# EasyEDA Pro project ZYNQ7020核心板-双DDR-V2.1.epro, schematic Schematic1_4

## Sheets
1 POWER: Board Name: 核心板_双面; Create Date: 2025-01-06; Page Name: POWER; Project Name: ZYNQ7020核心板-双DDR; Schematic Name: Schematic1_4; Update Date: 2025-04-12; Company: ZXLAB; Page Size: A4; Reviewed: ZXLAB; Version: V1.2
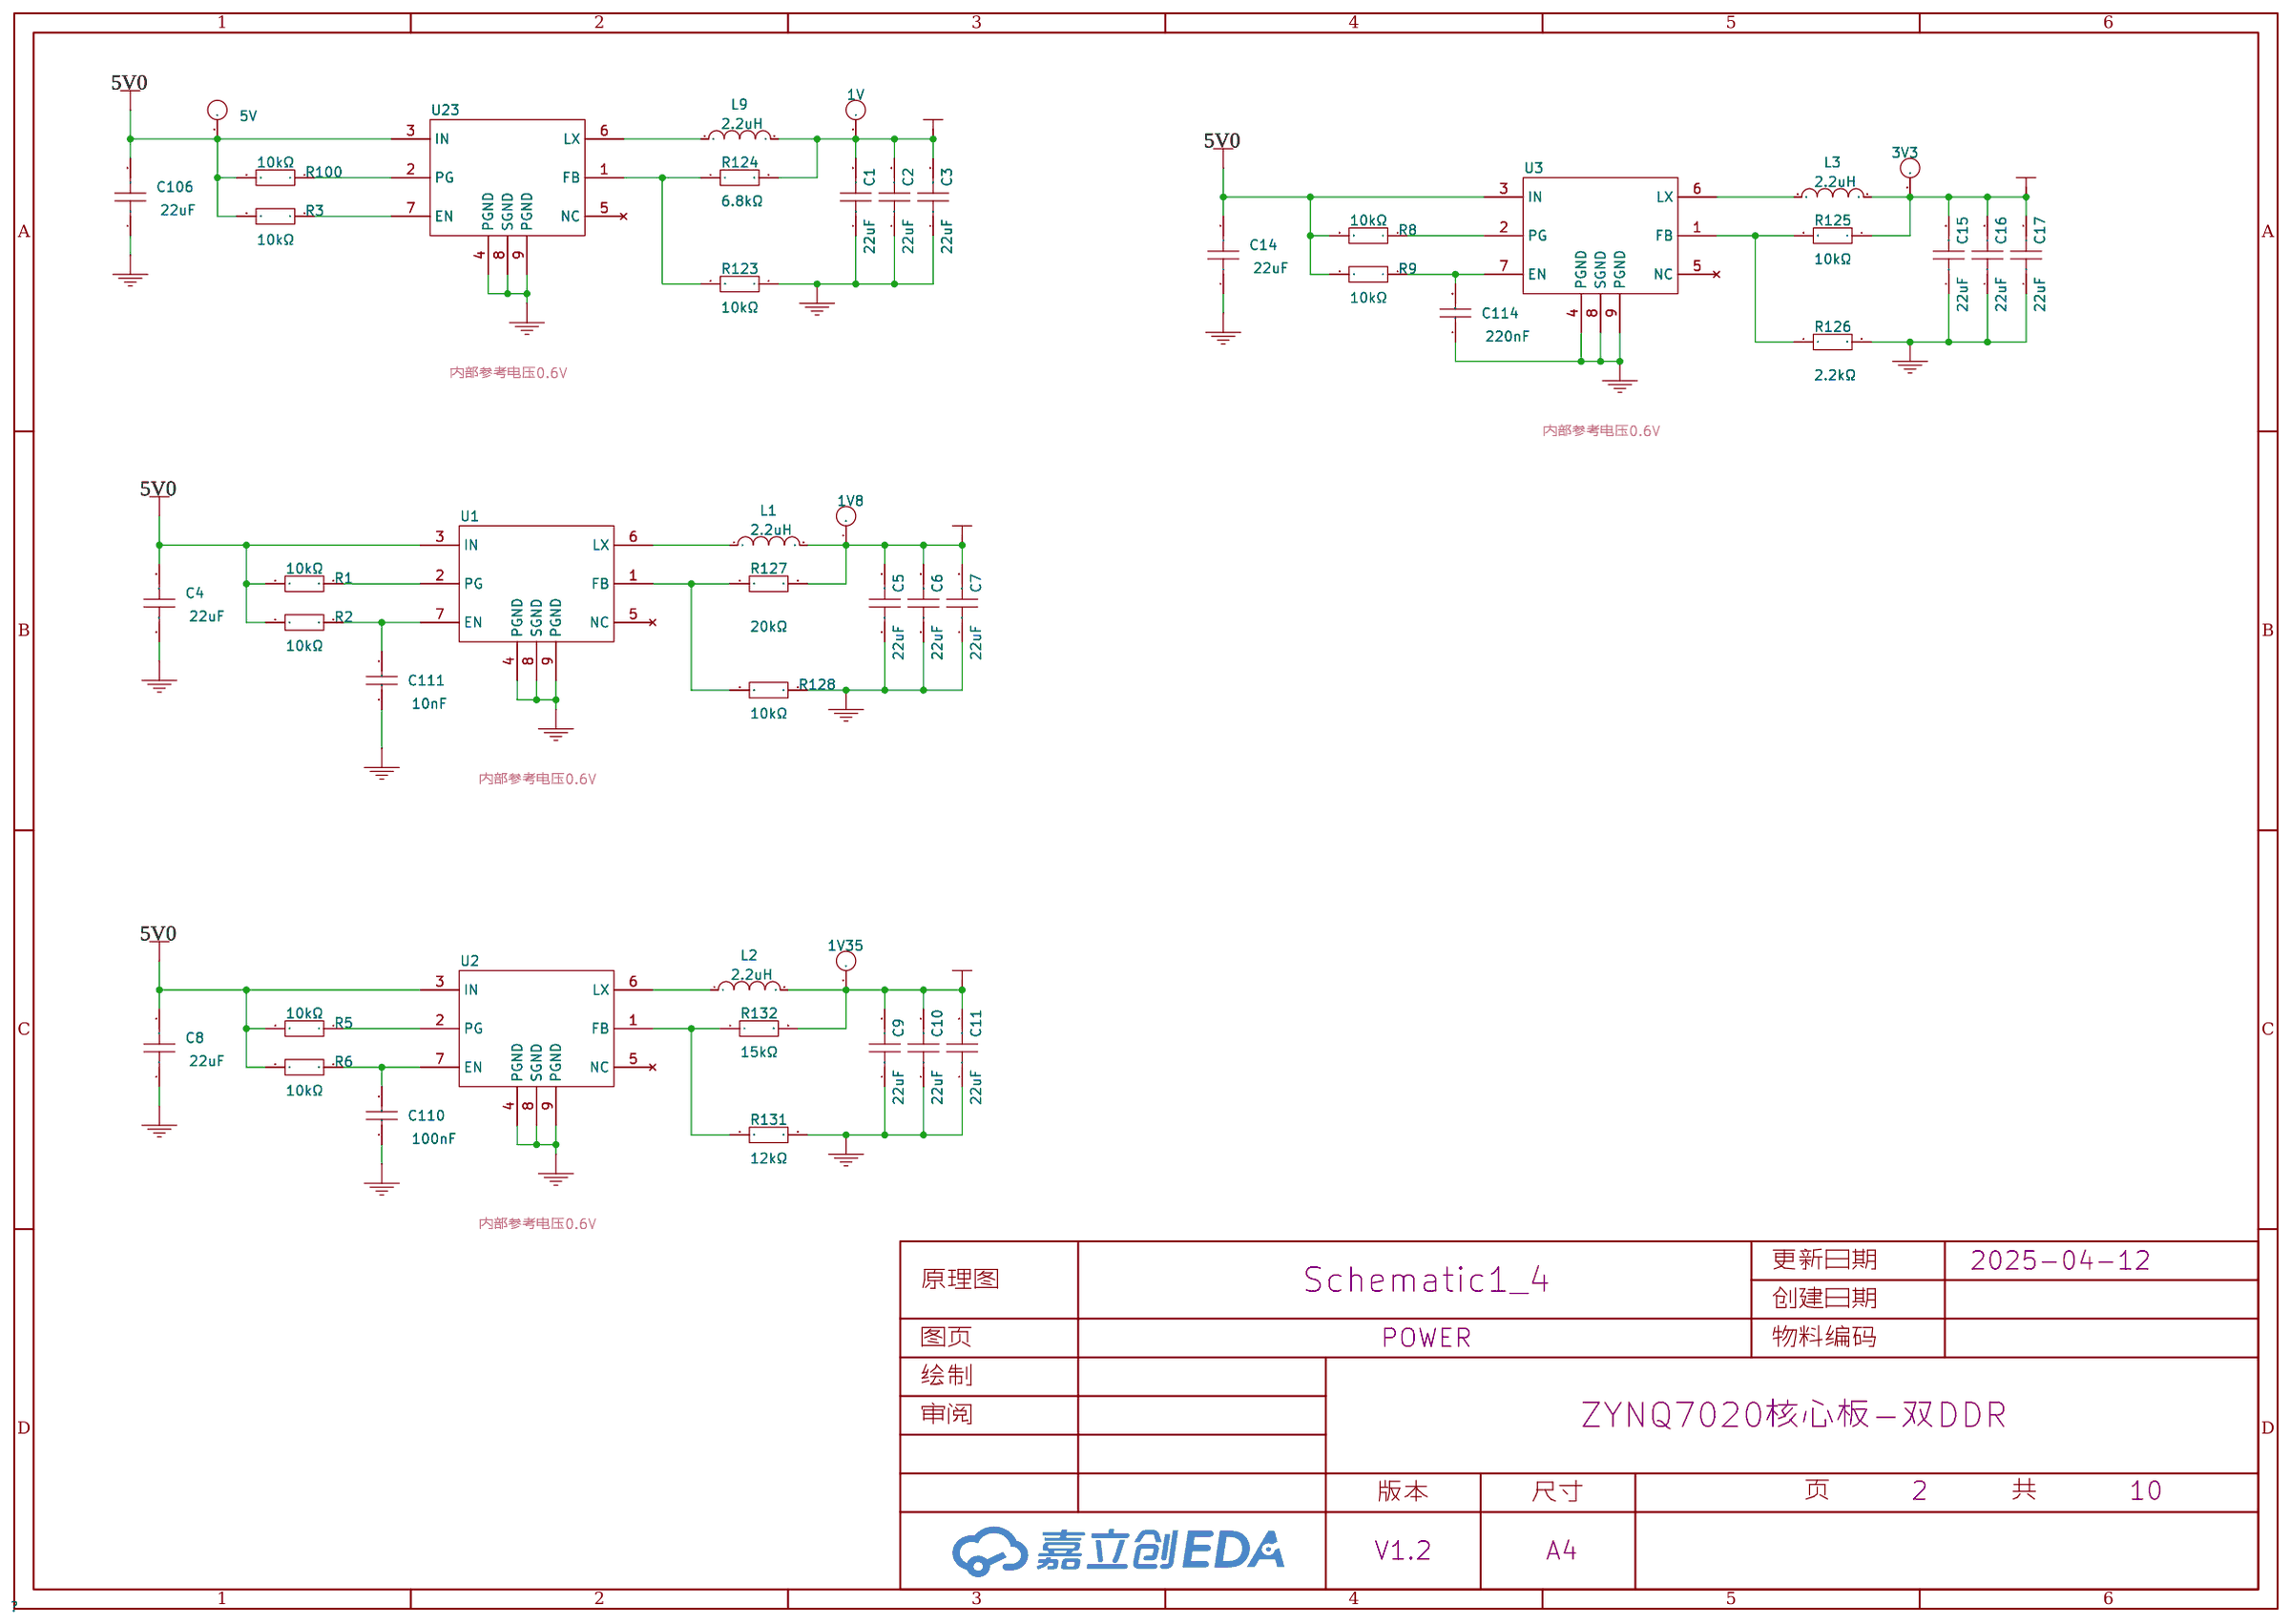
[diagram p0: POWER]
2 MEM: Page Name: MEM
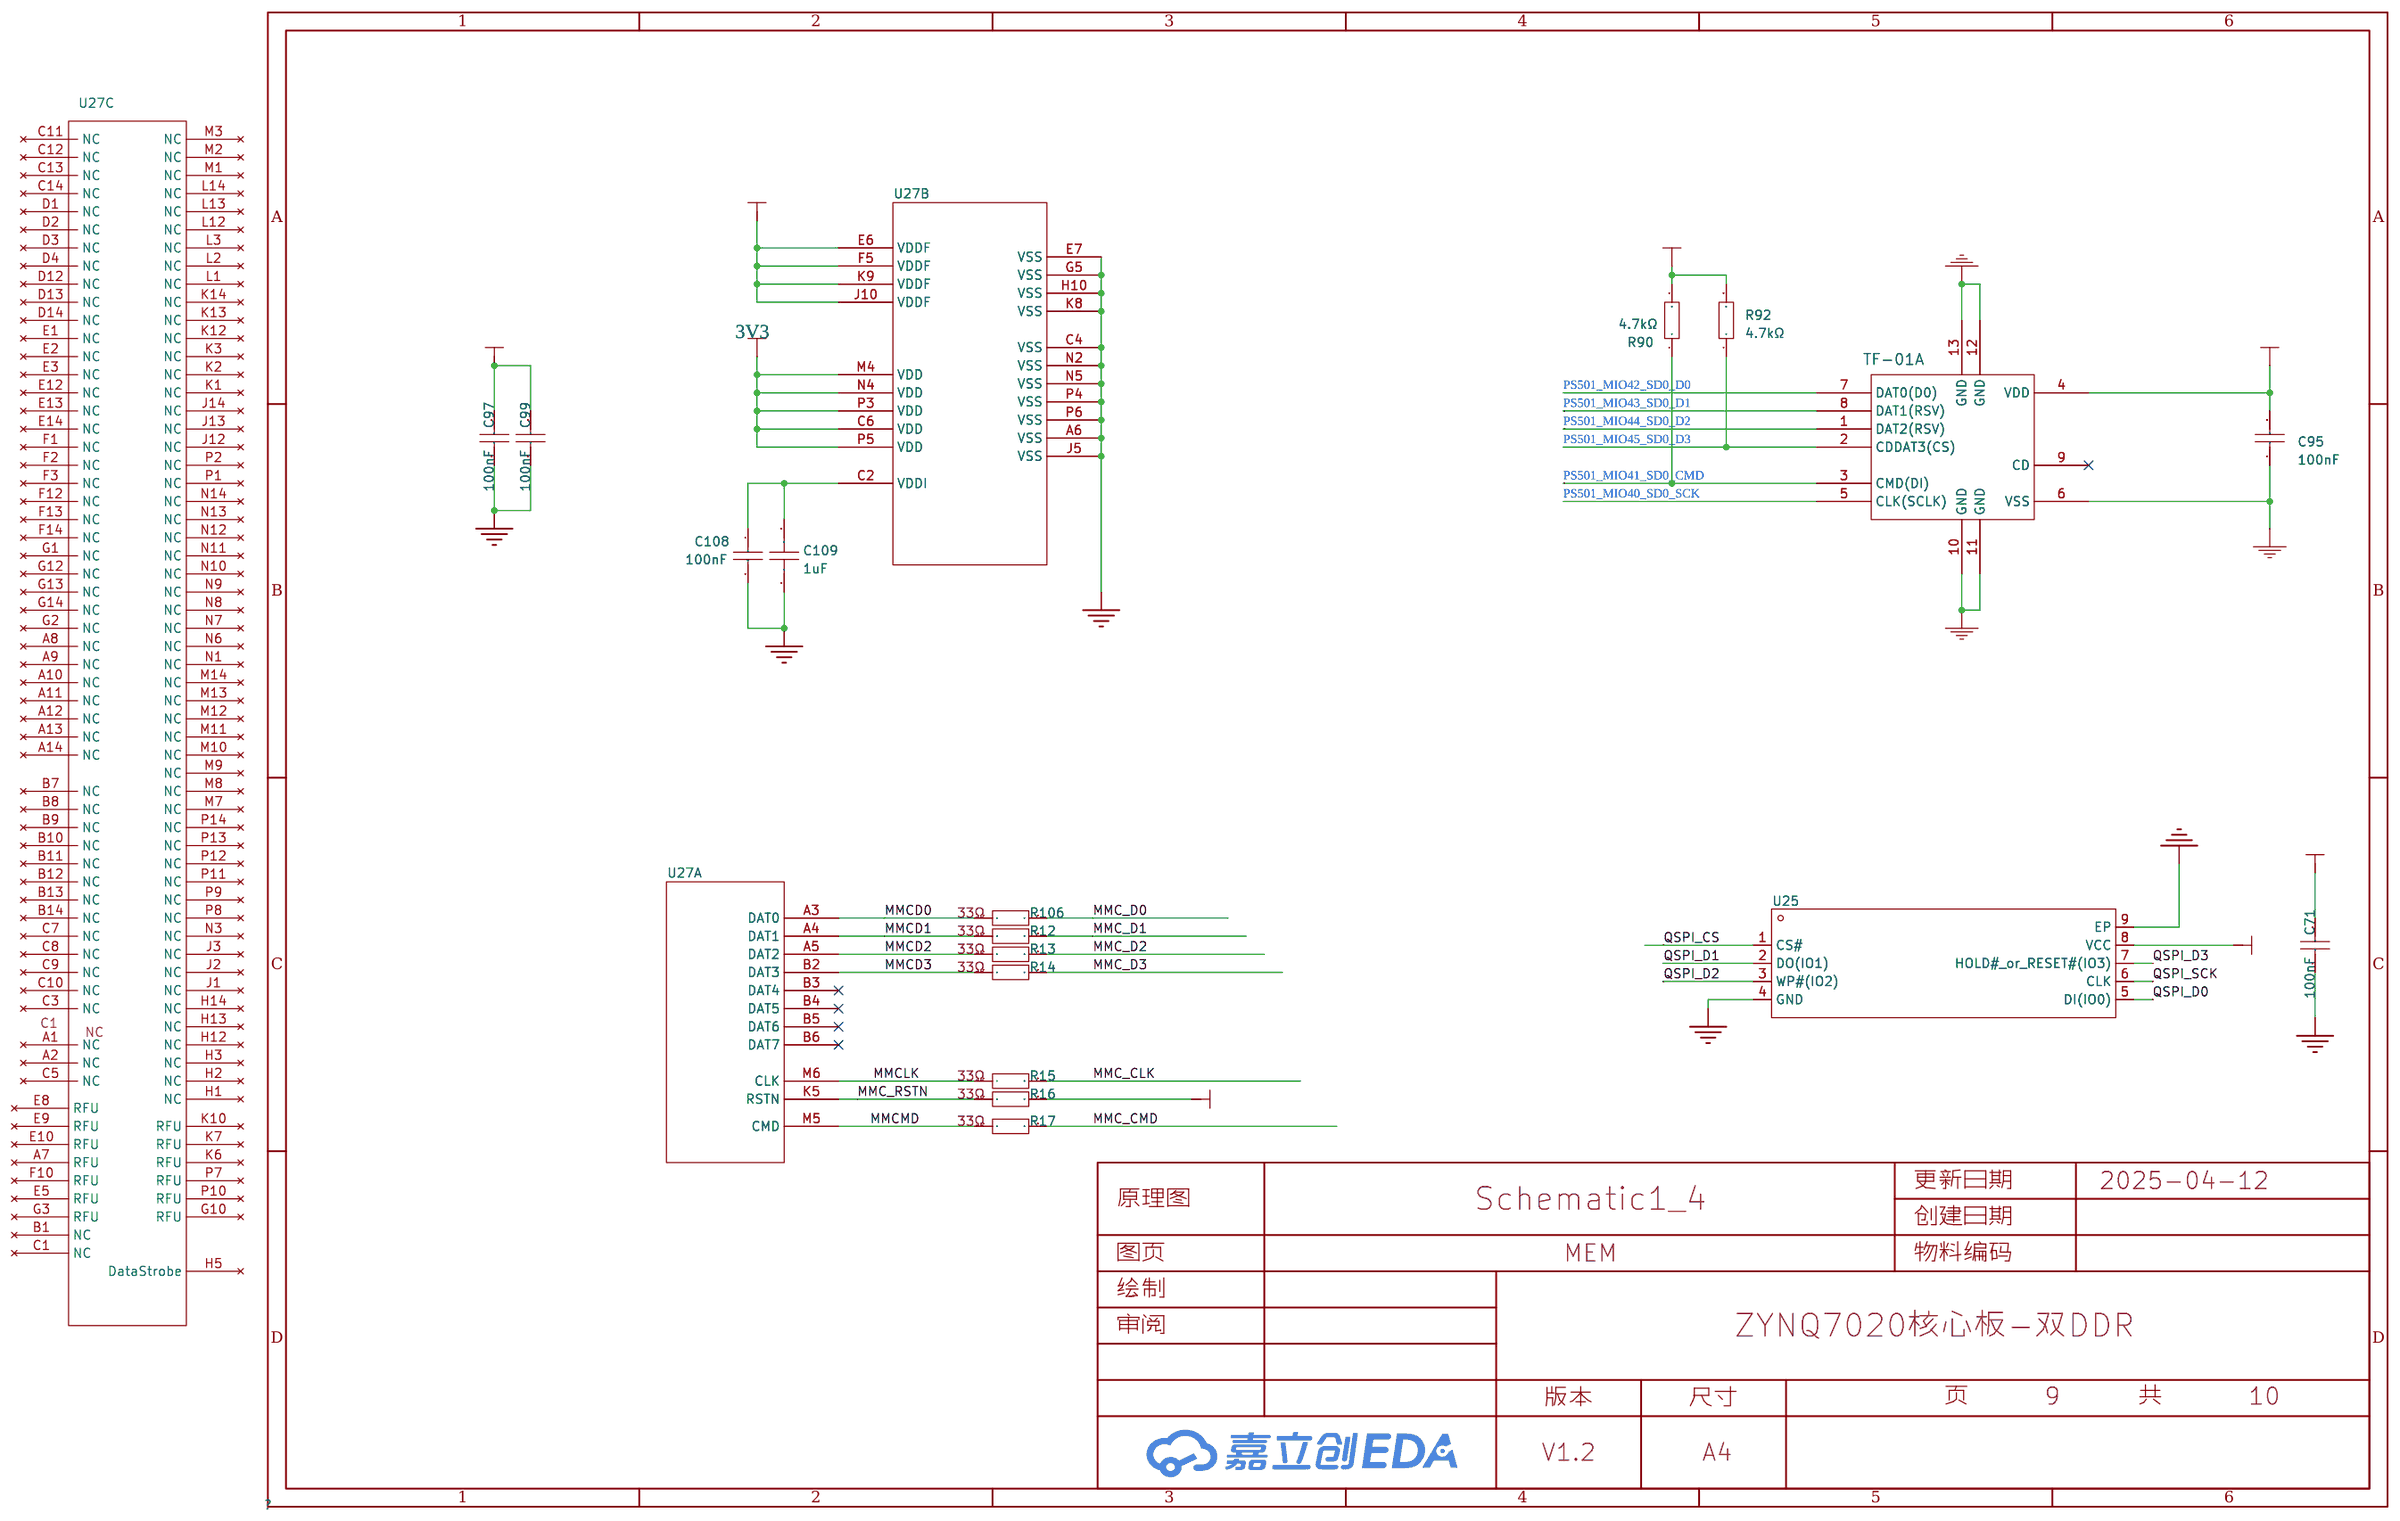
[diagram p1: MEM]
3 ZYNQ_PS: Page Name: ZYNQ_PS
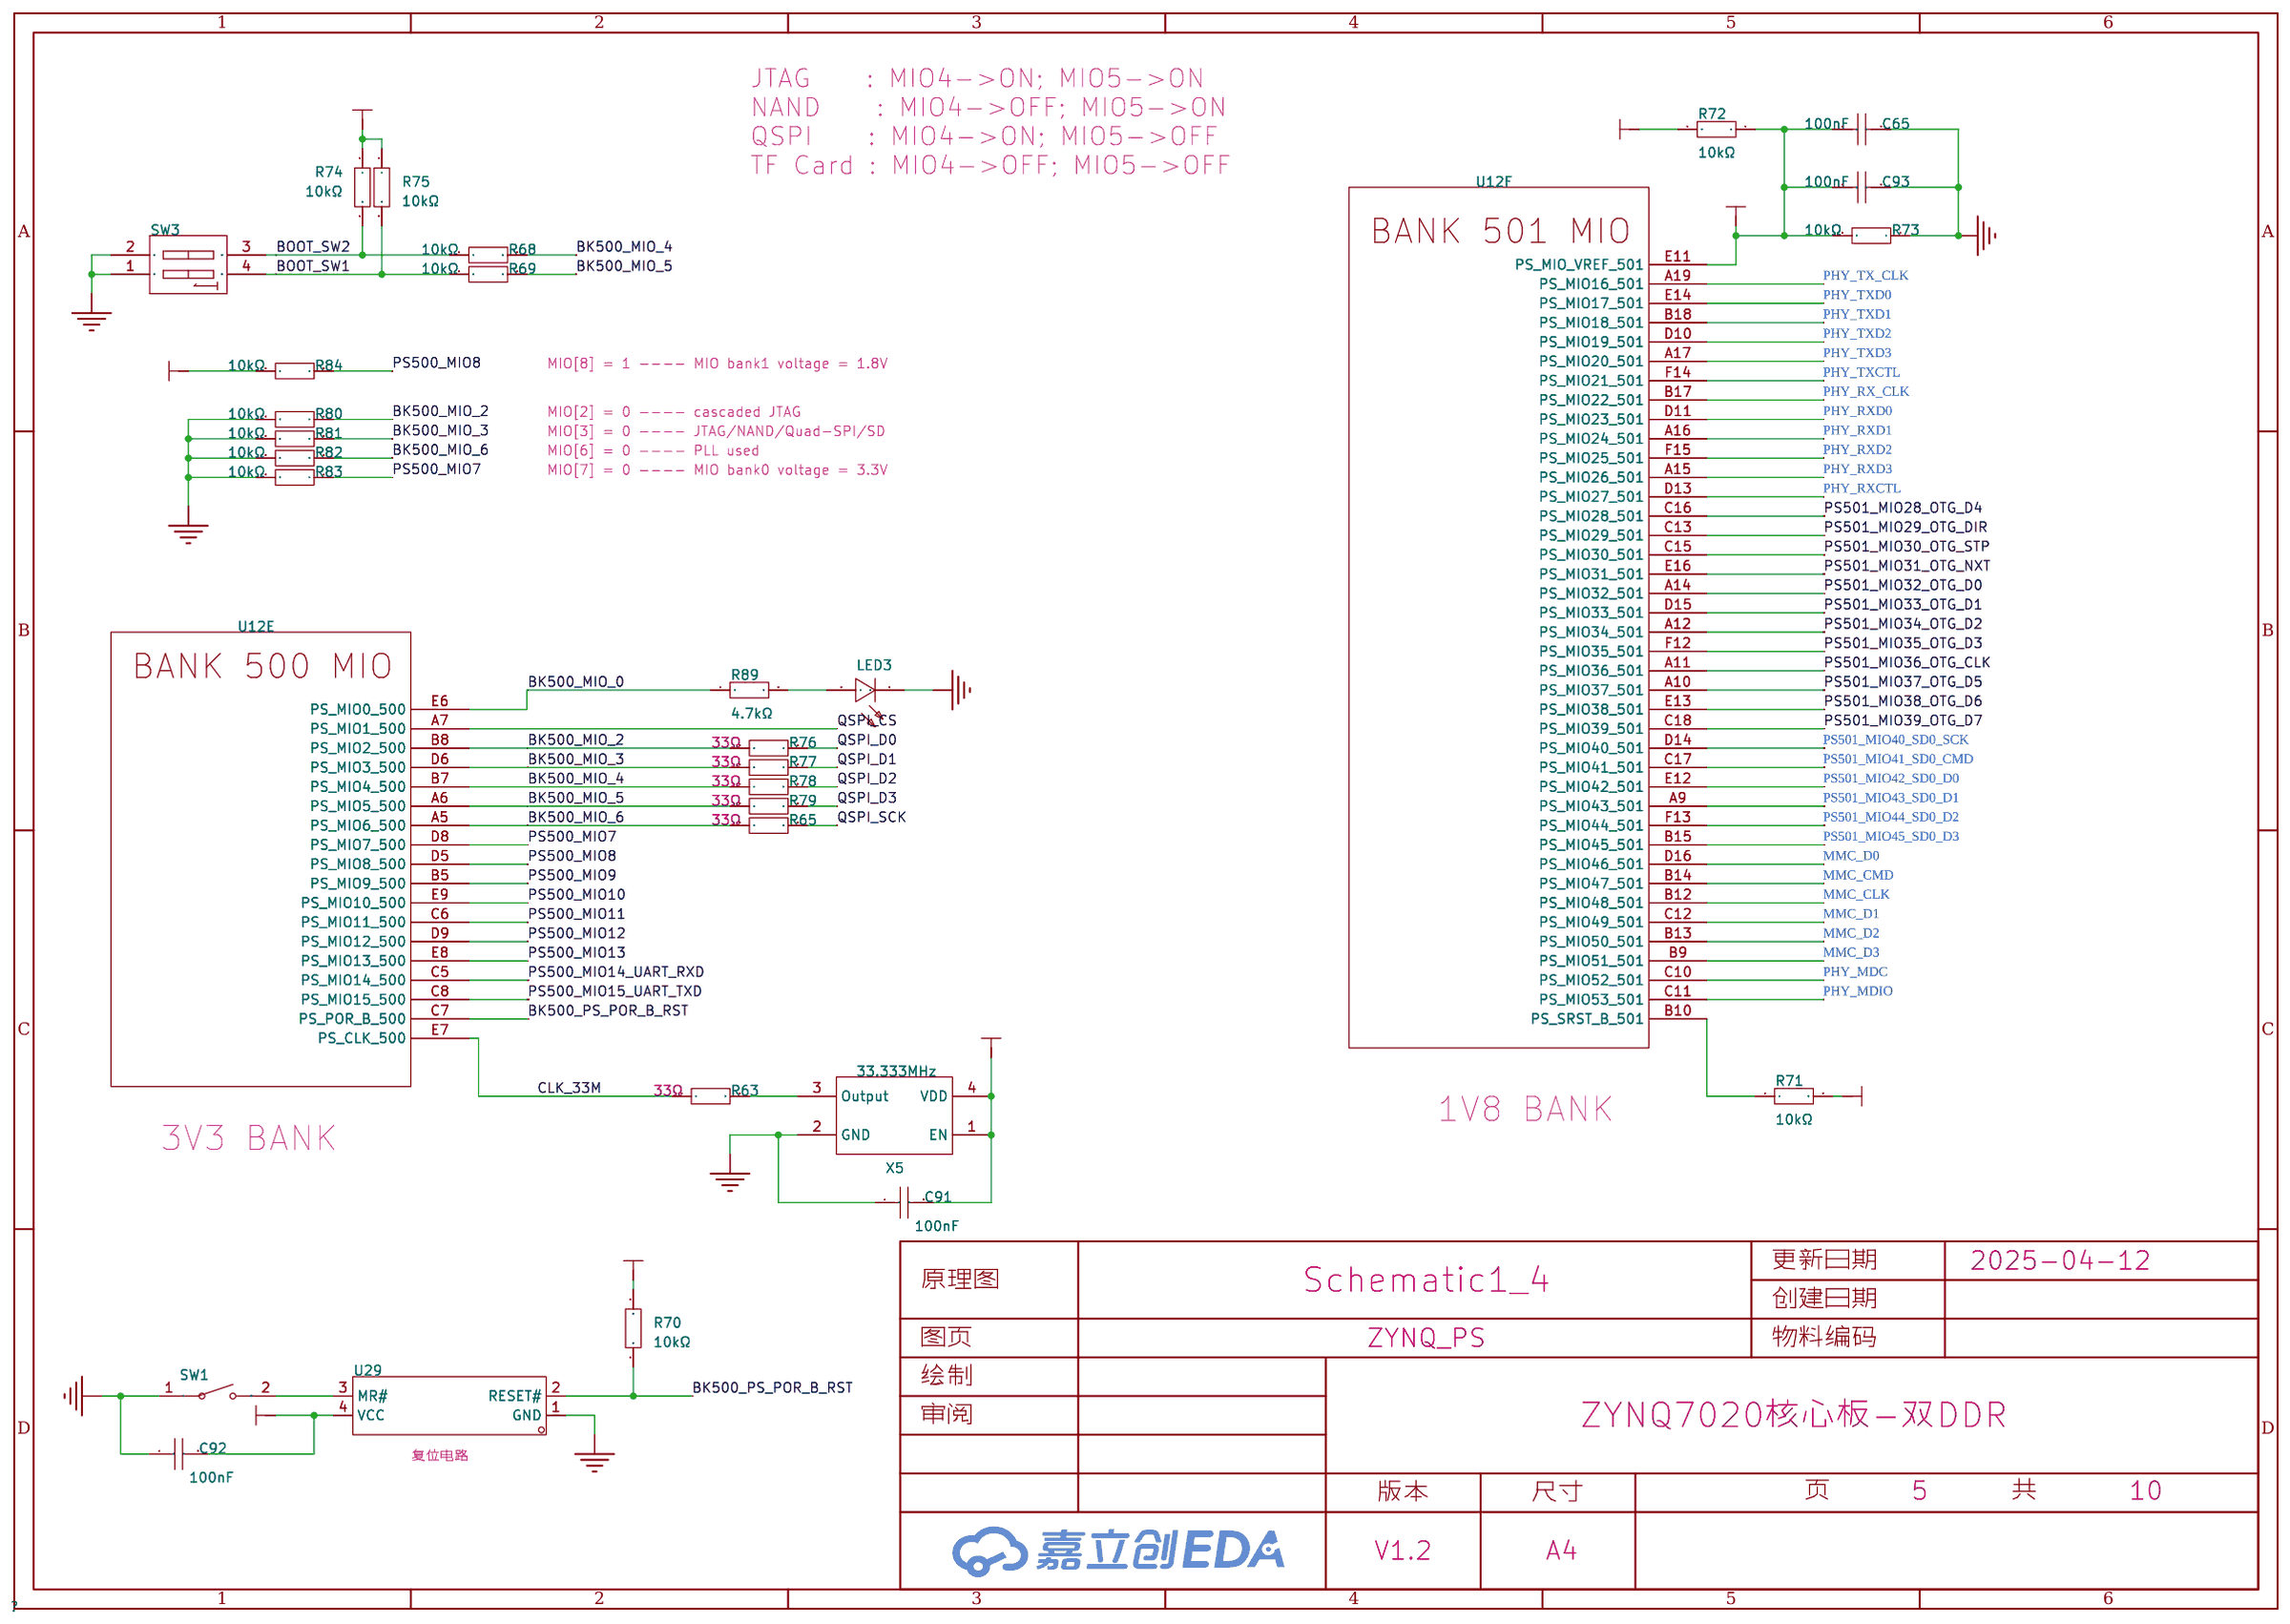
[diagram p2: ZYNQ_PS]
4 ZYNQ_PWR: Page Name: ZYNQ_PWR; Page Size: A3
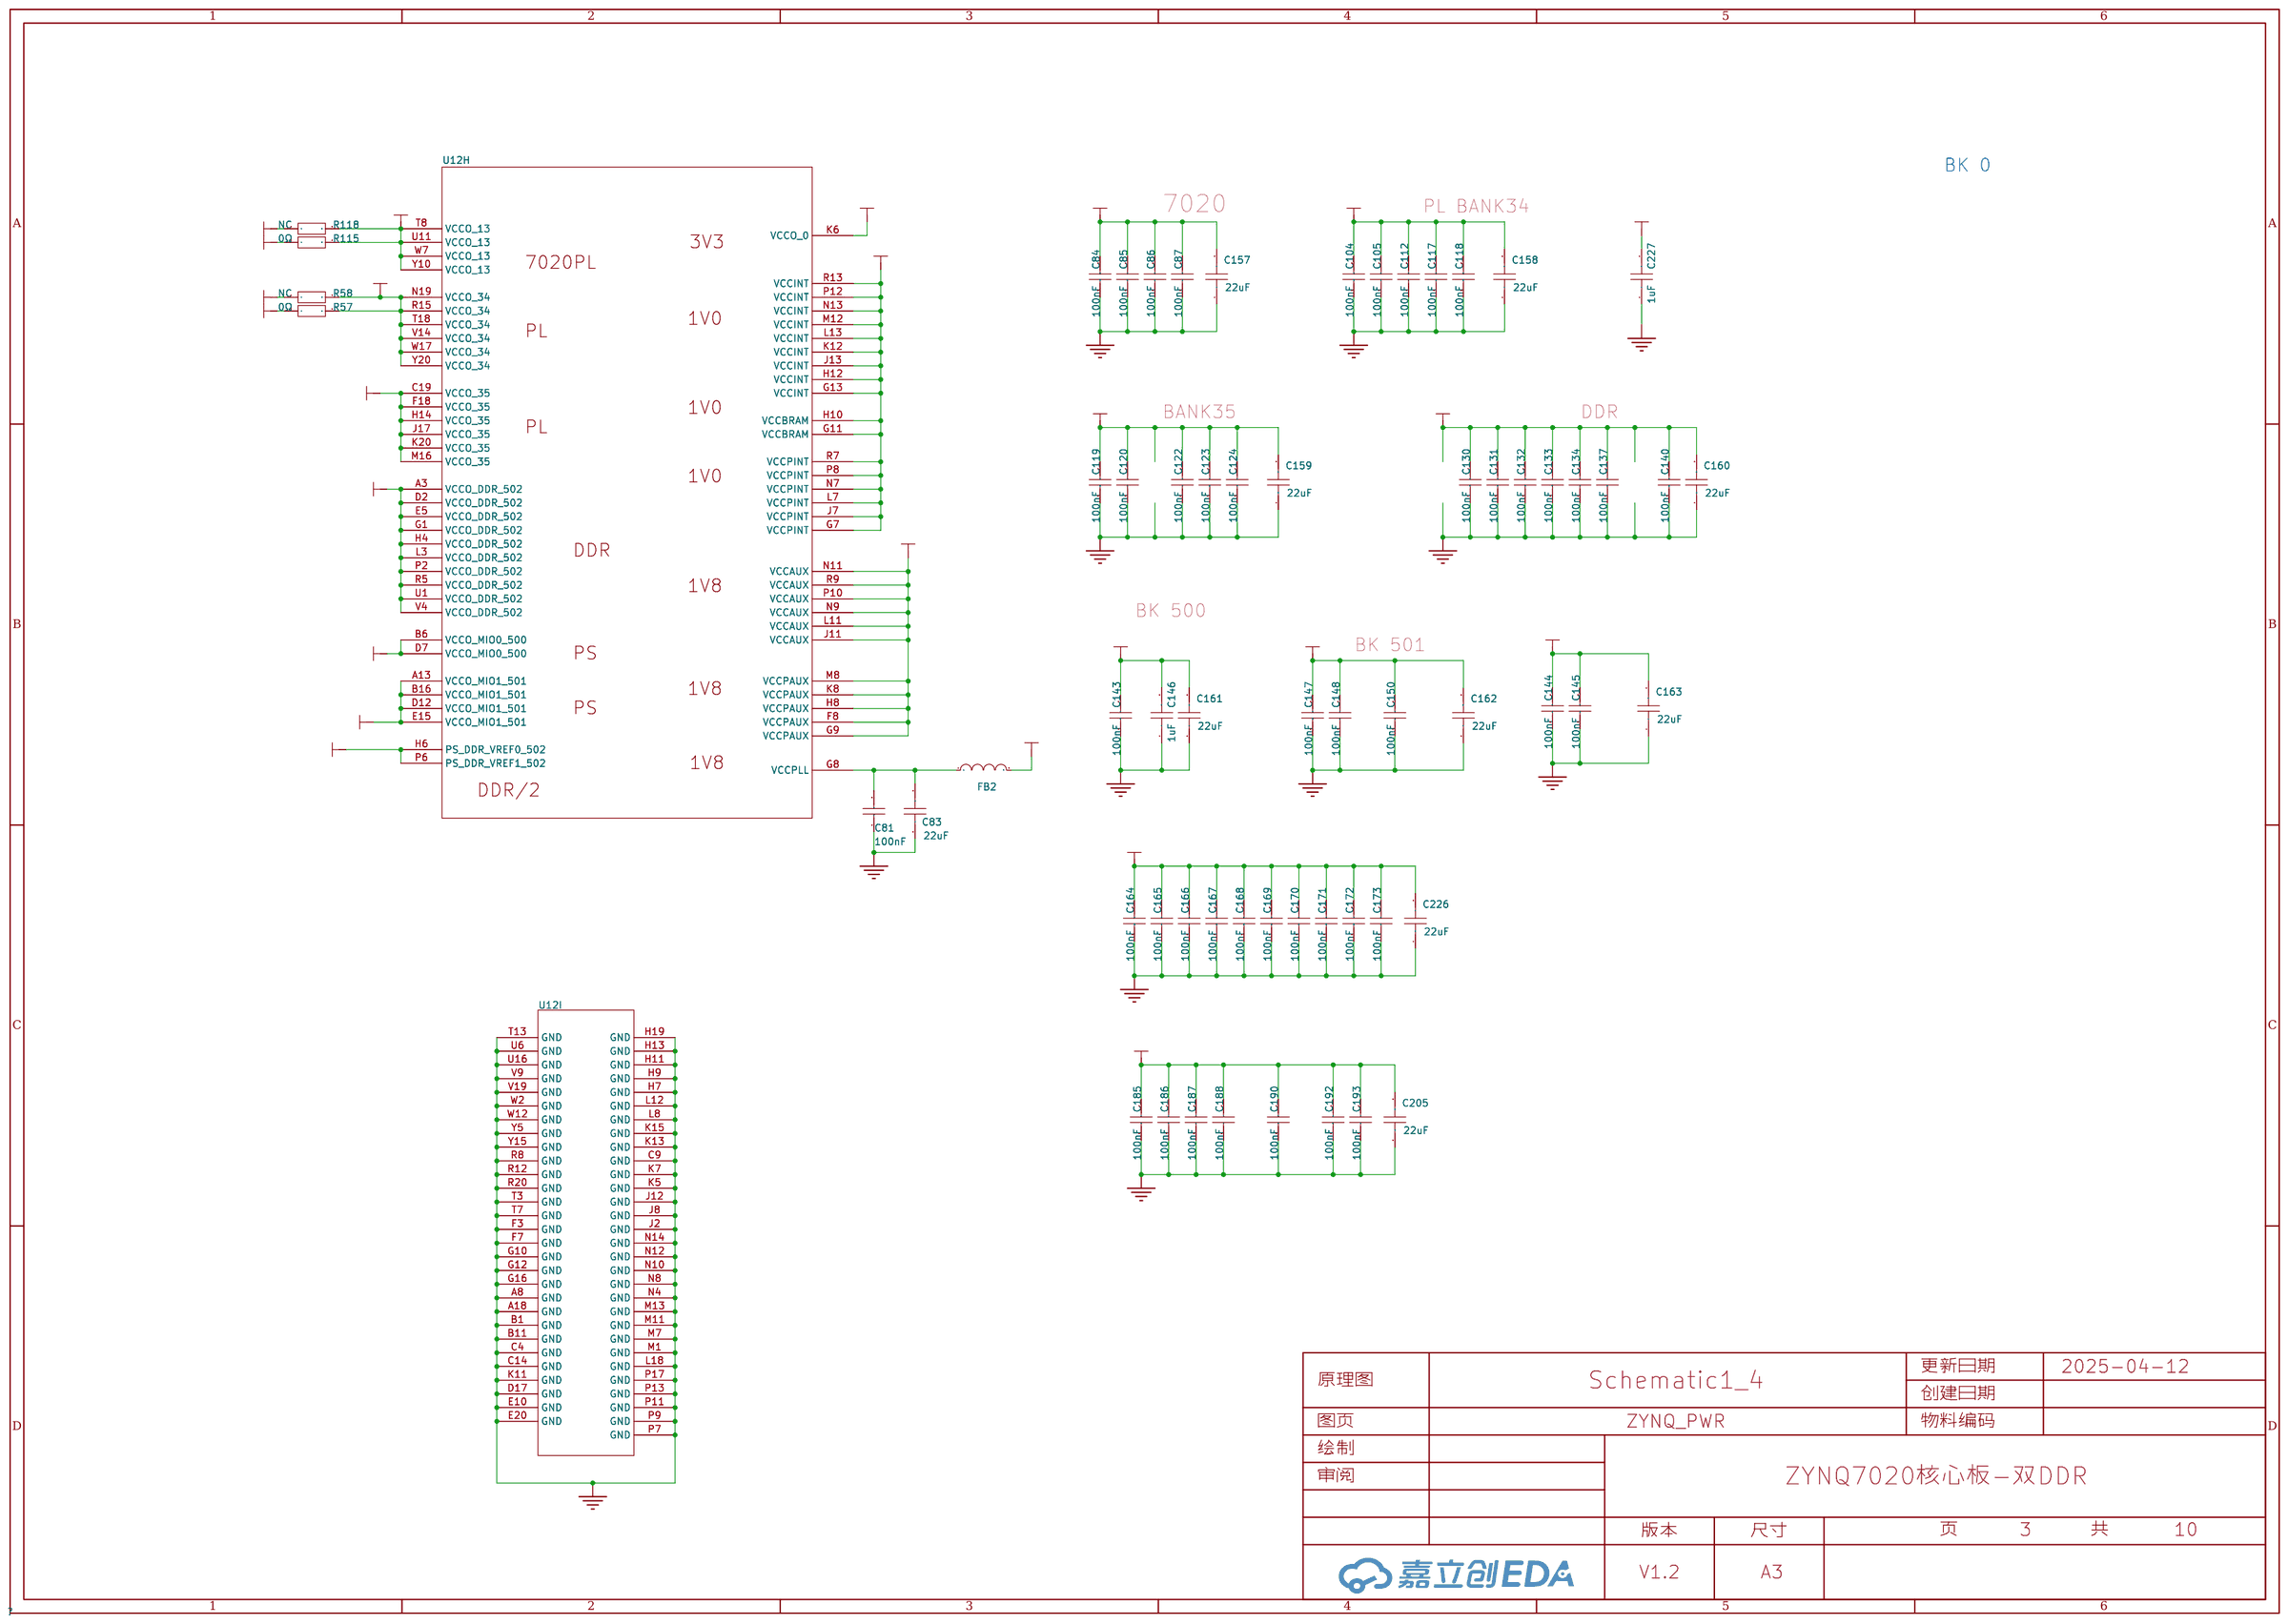
[diagram p3: ZYNQ_PWR]
5 DDR3: Page Name: DDR3
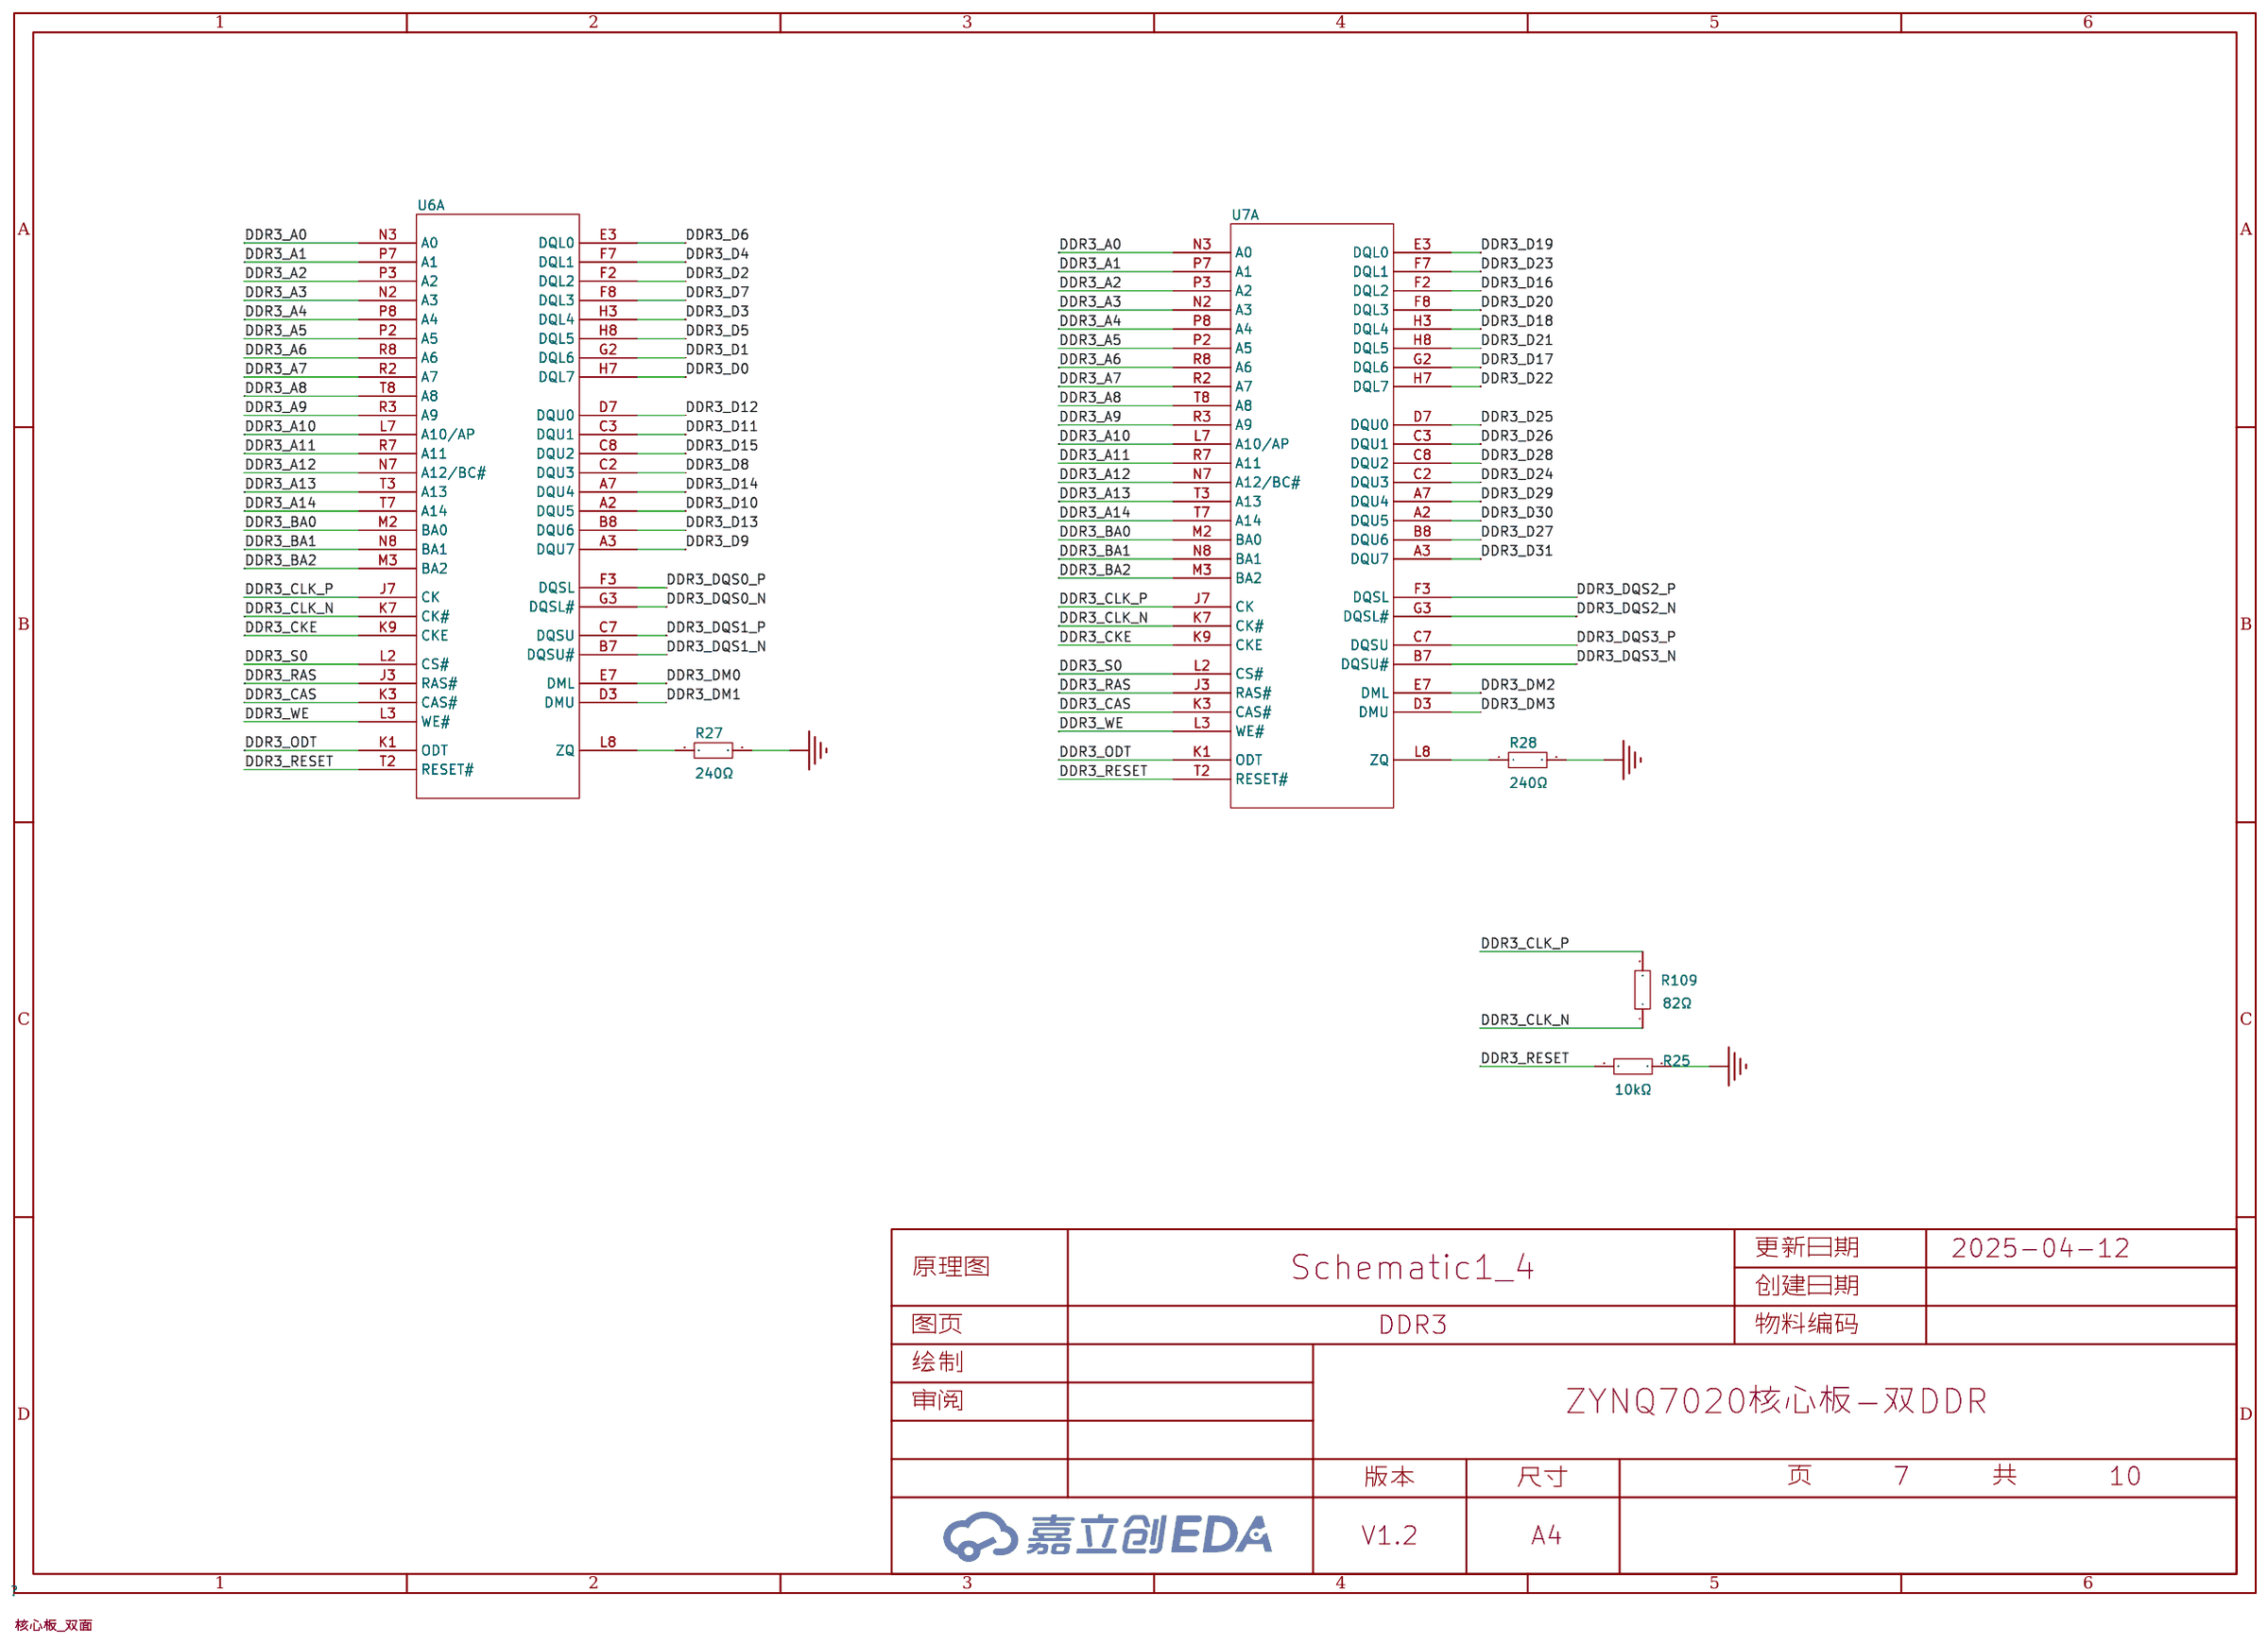
[diagram p4: DDR3]
6 ZYNQ_PL: Page Name: ZYNQ_PL
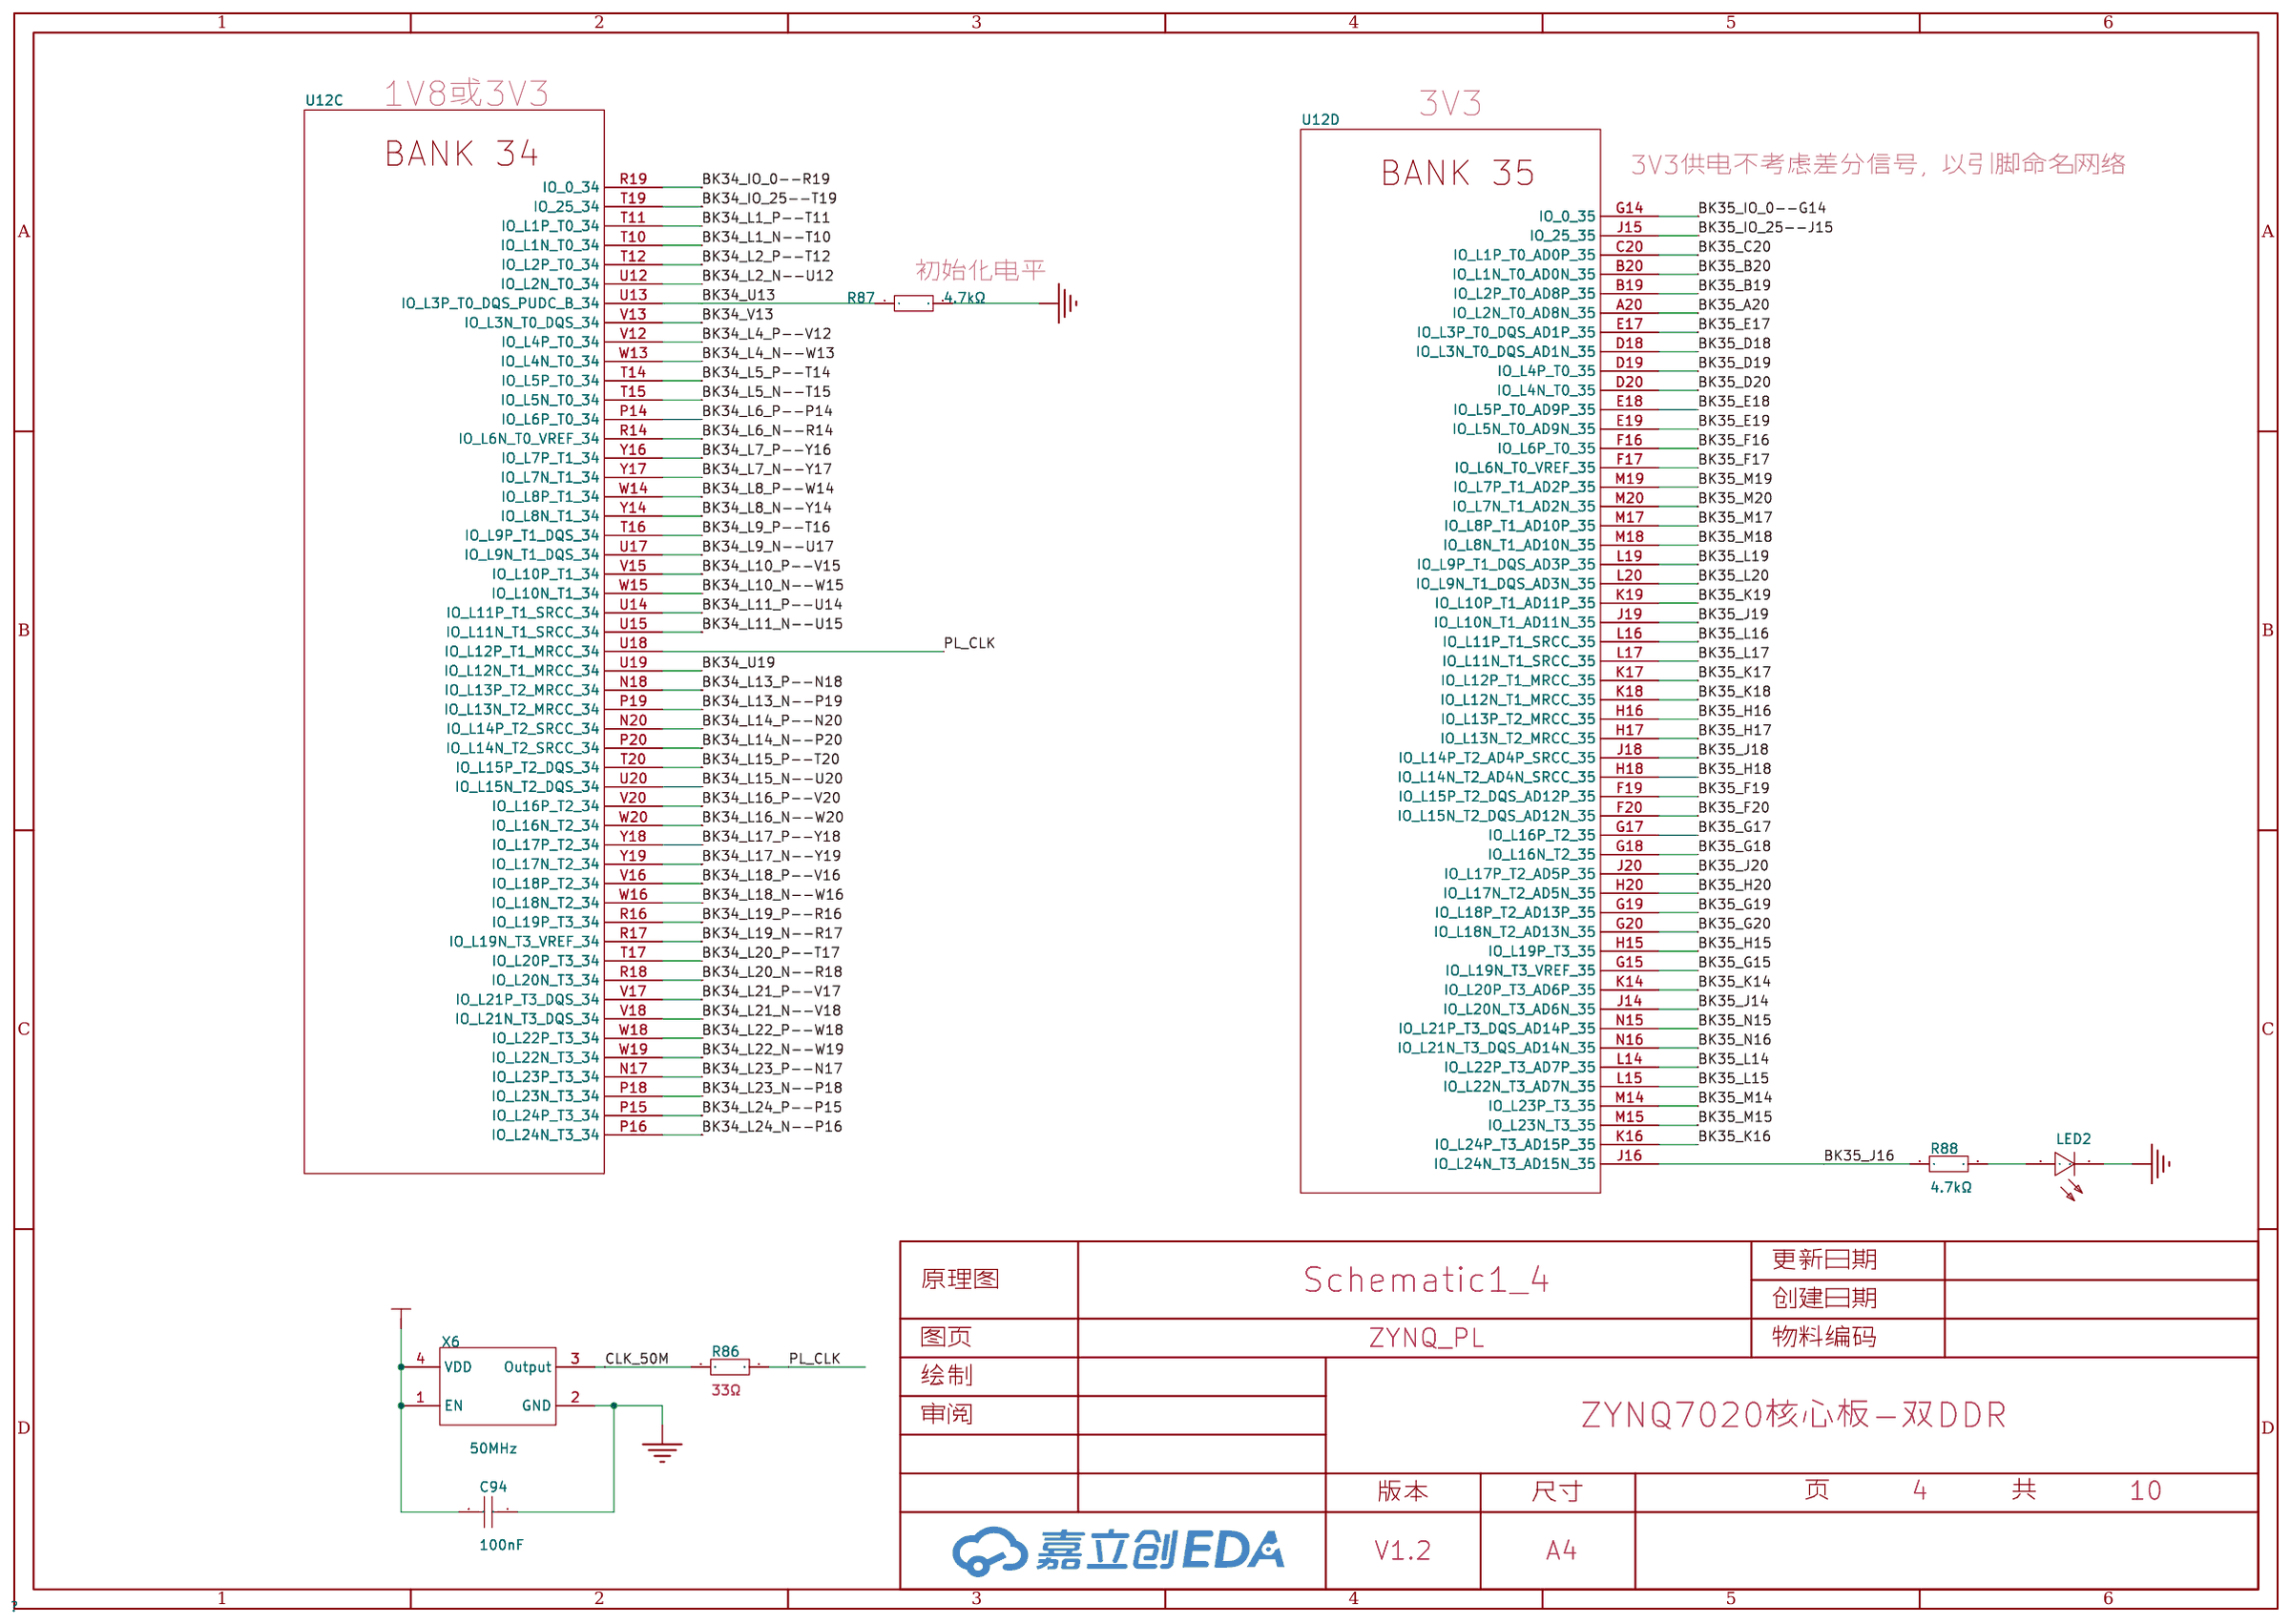
[diagram p5: ZYNQ_PL]
7 ZYNQ_FUC: Page Name: ZYNQ_FUC
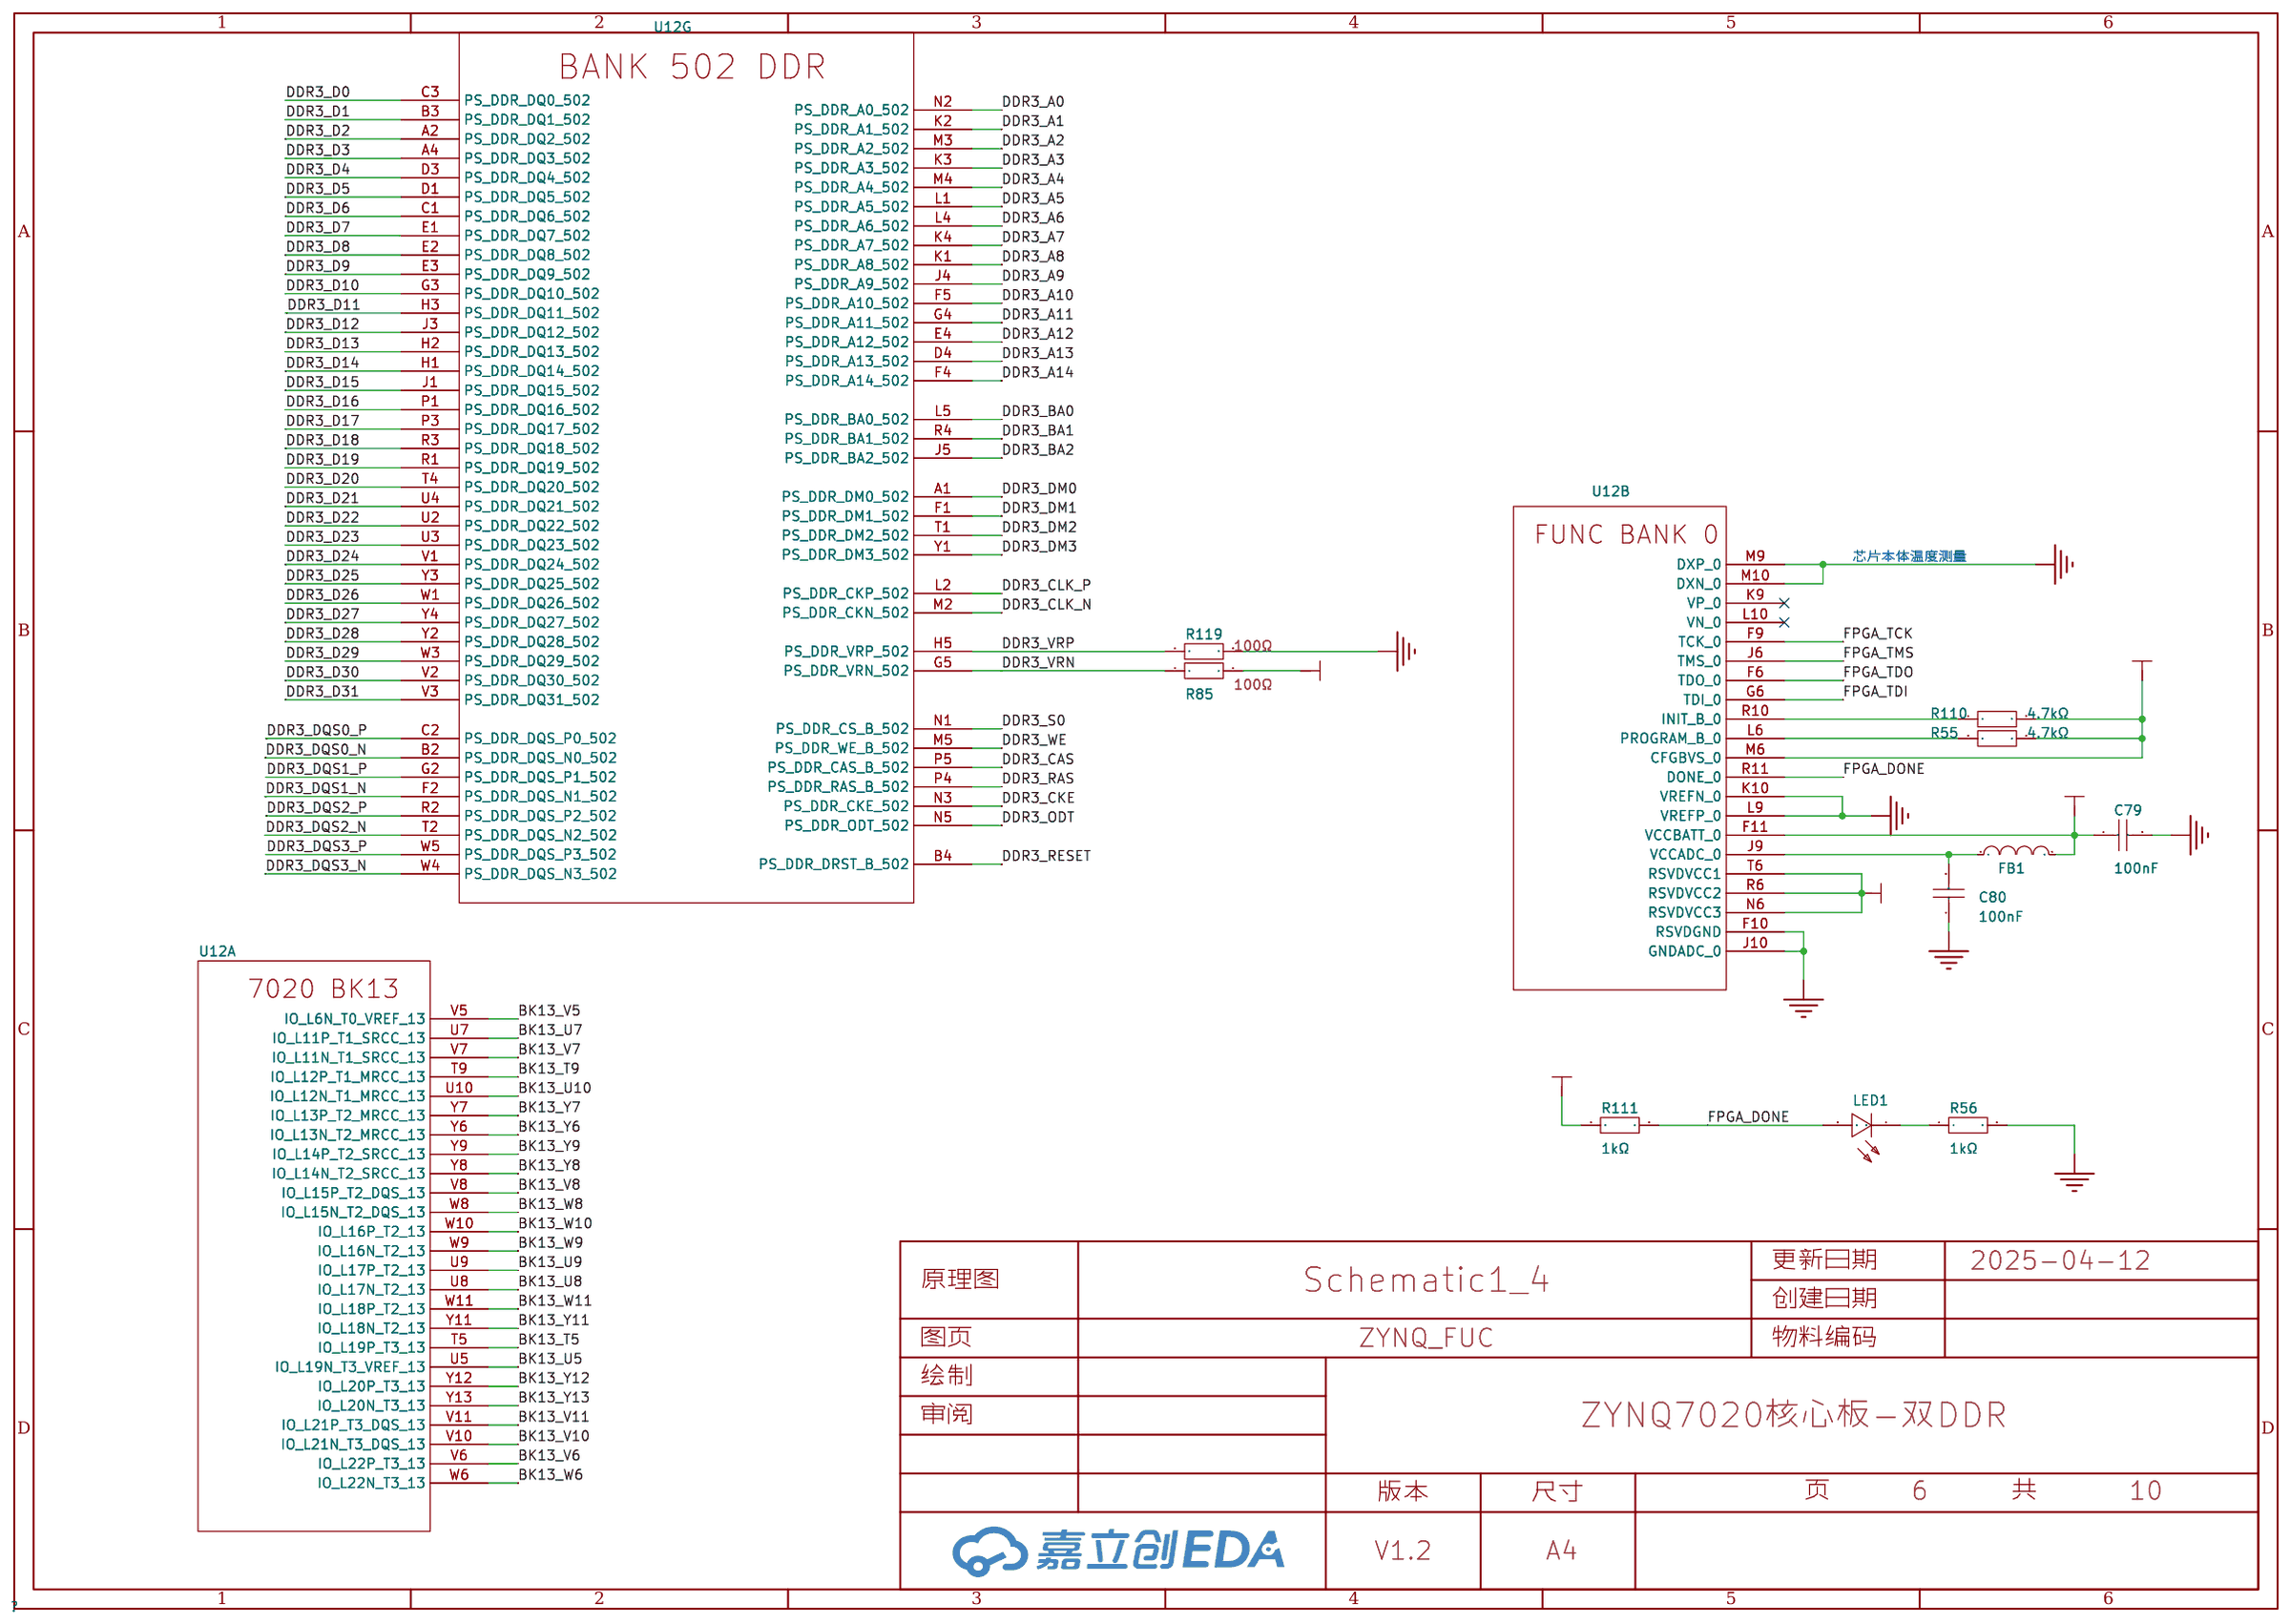
[diagram p6: ZYNQ_FUC]
8 ETHERNET: Page Name: ETHERNET
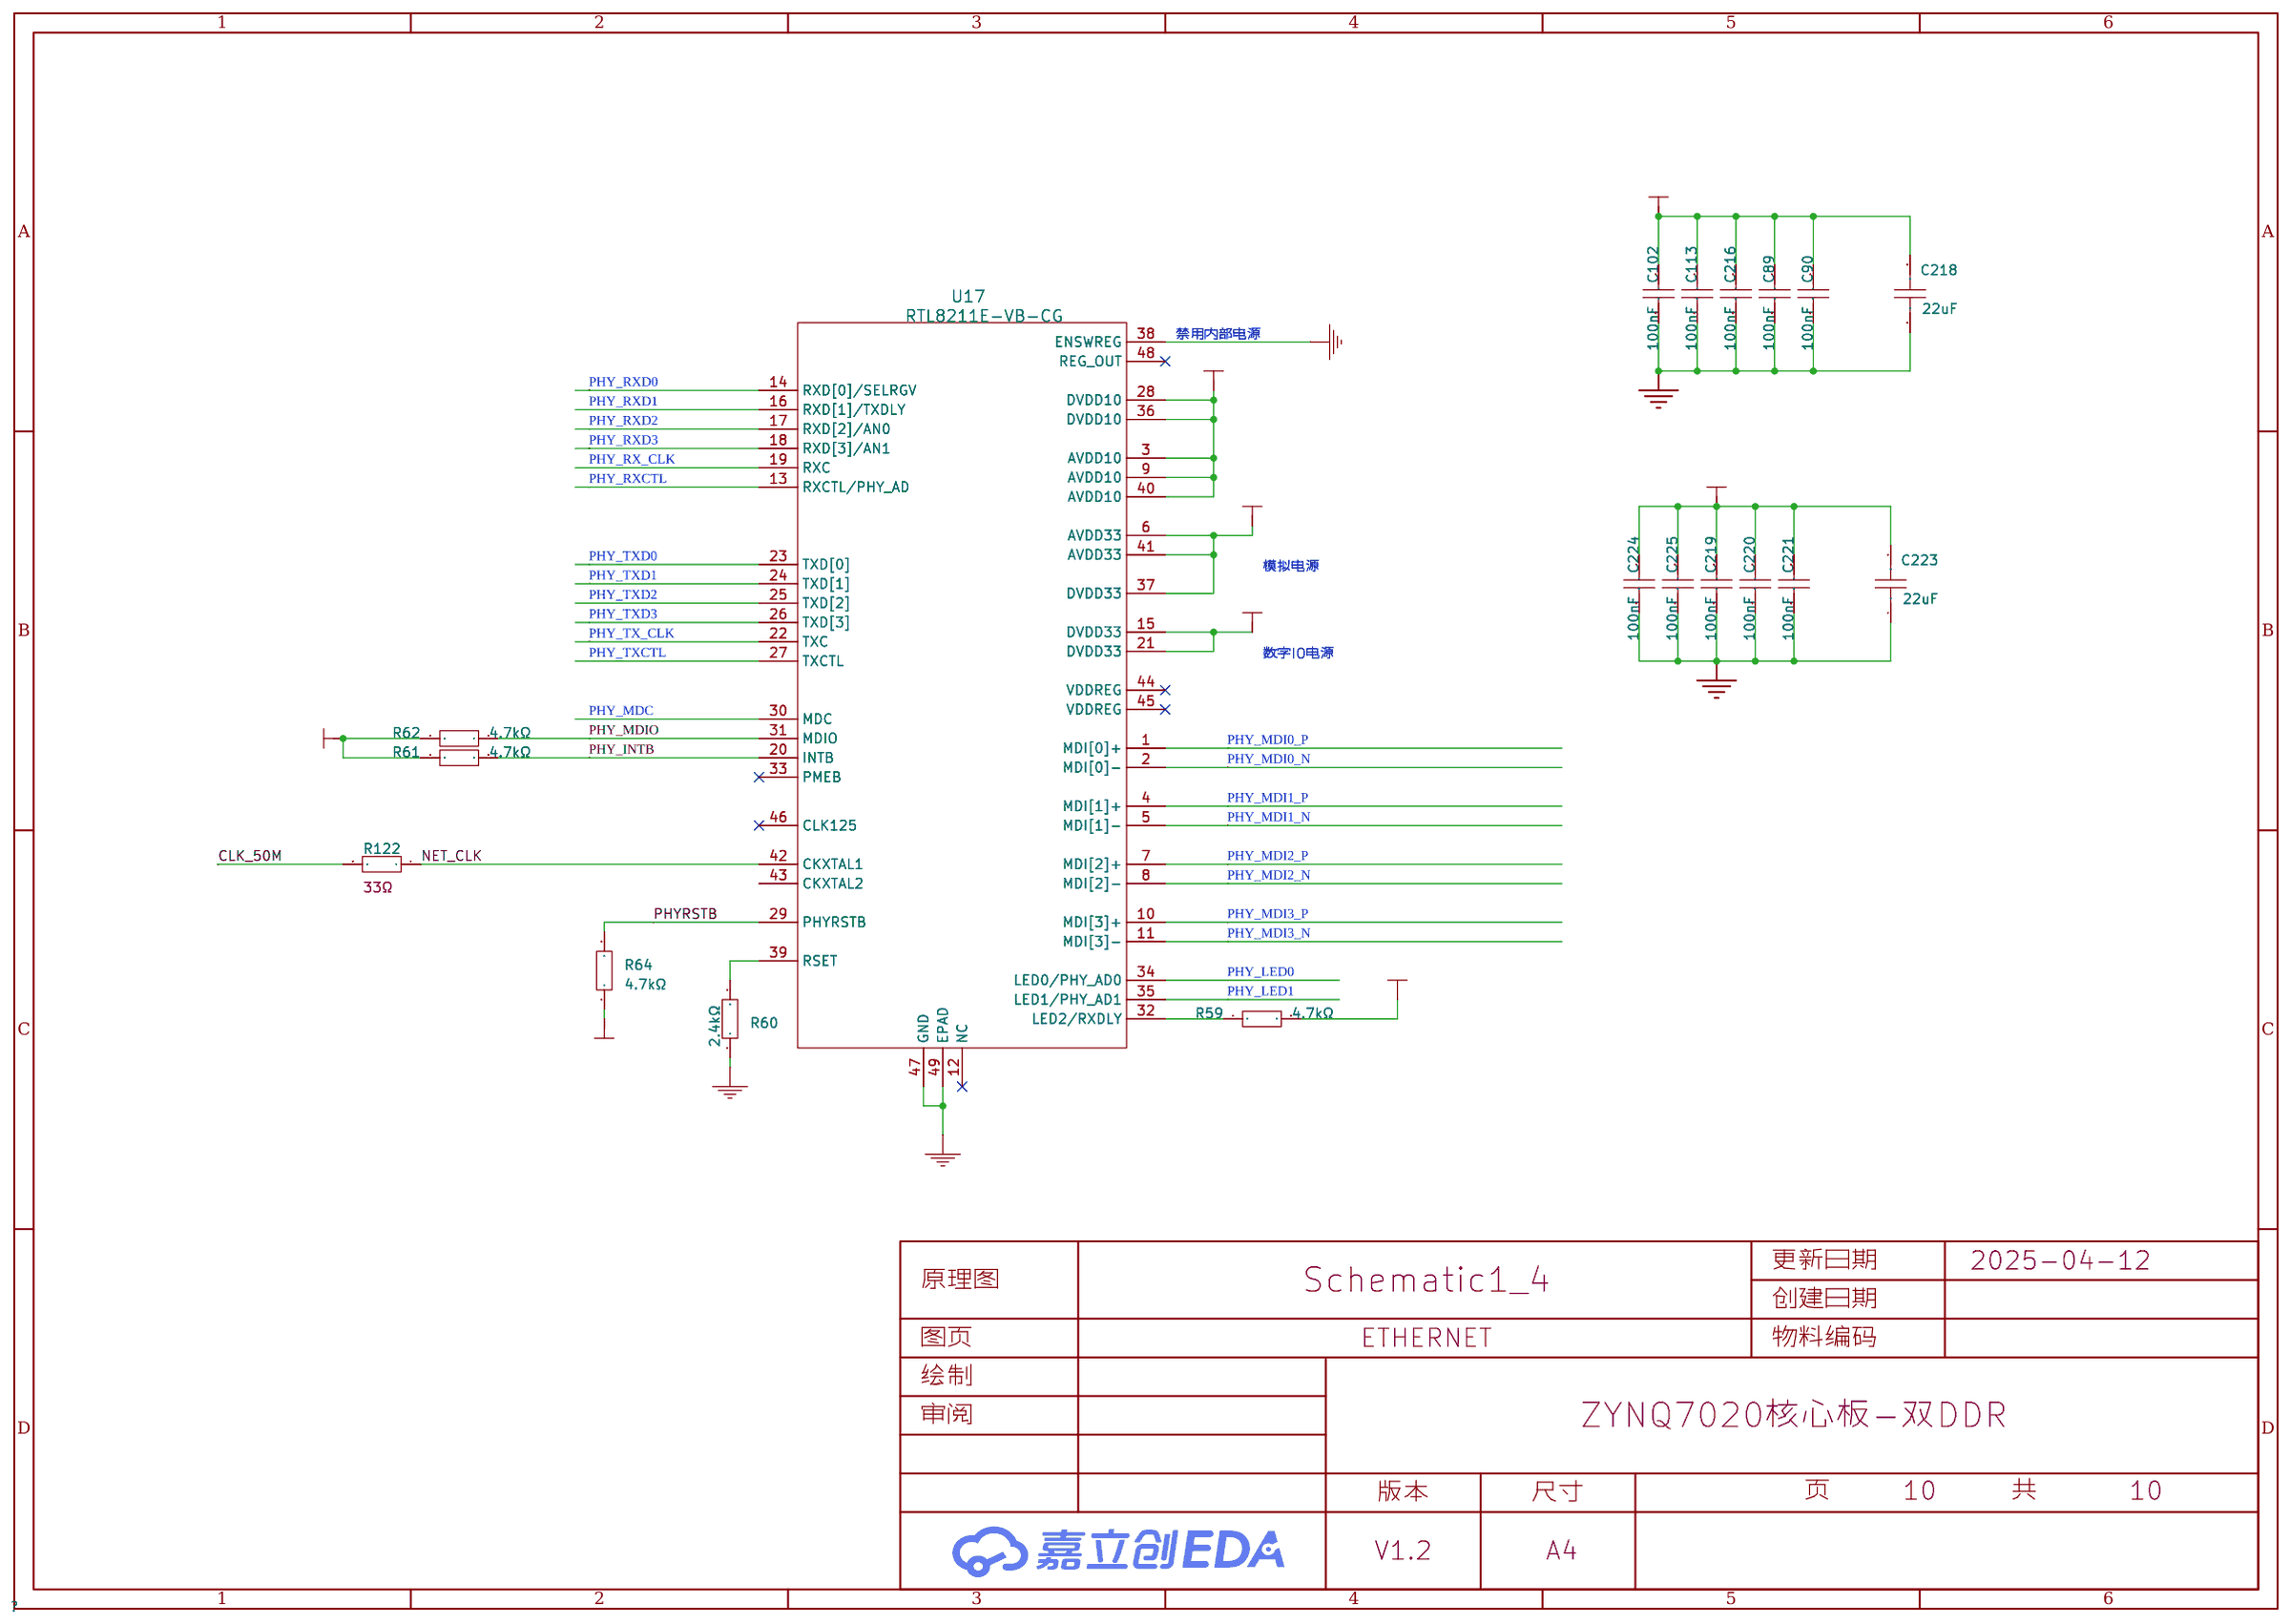
[diagram p7: ETHERNET]
9 CONNECTOR: Page Name: CONNECTOR
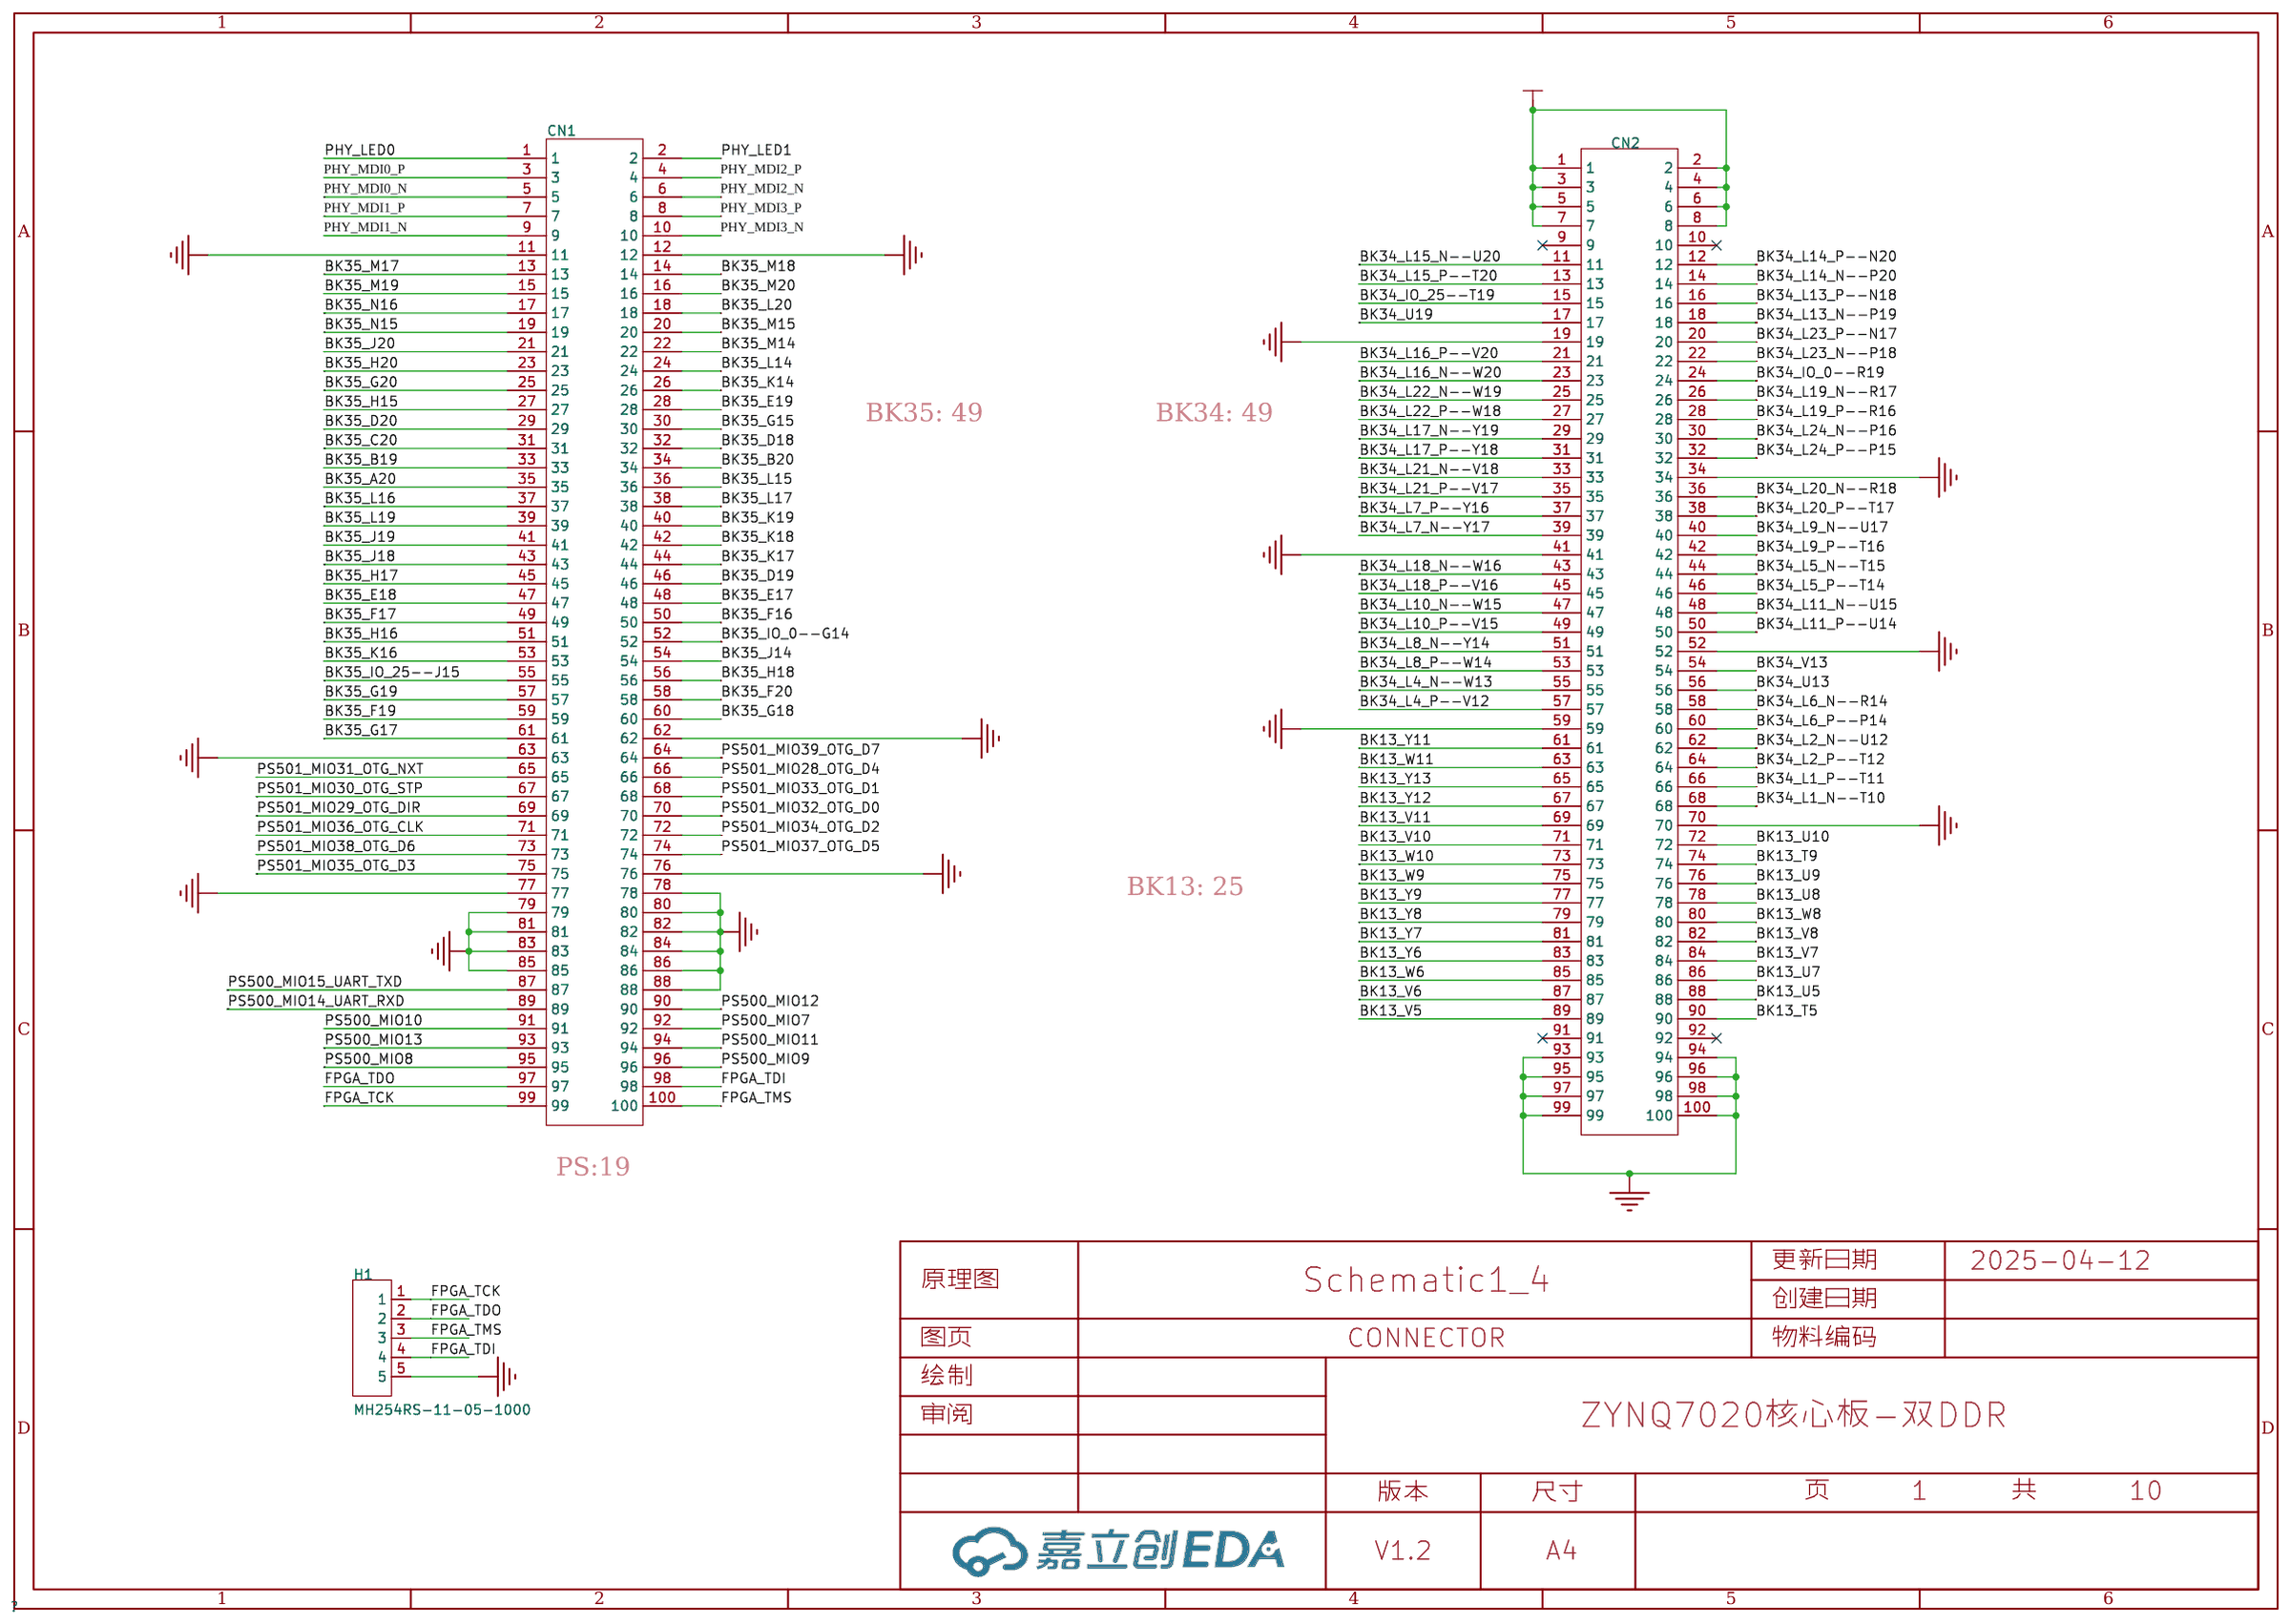
[diagram p8: CONNECTOR]
10 DDR3_PWR: Page Name: DDR3_PWR
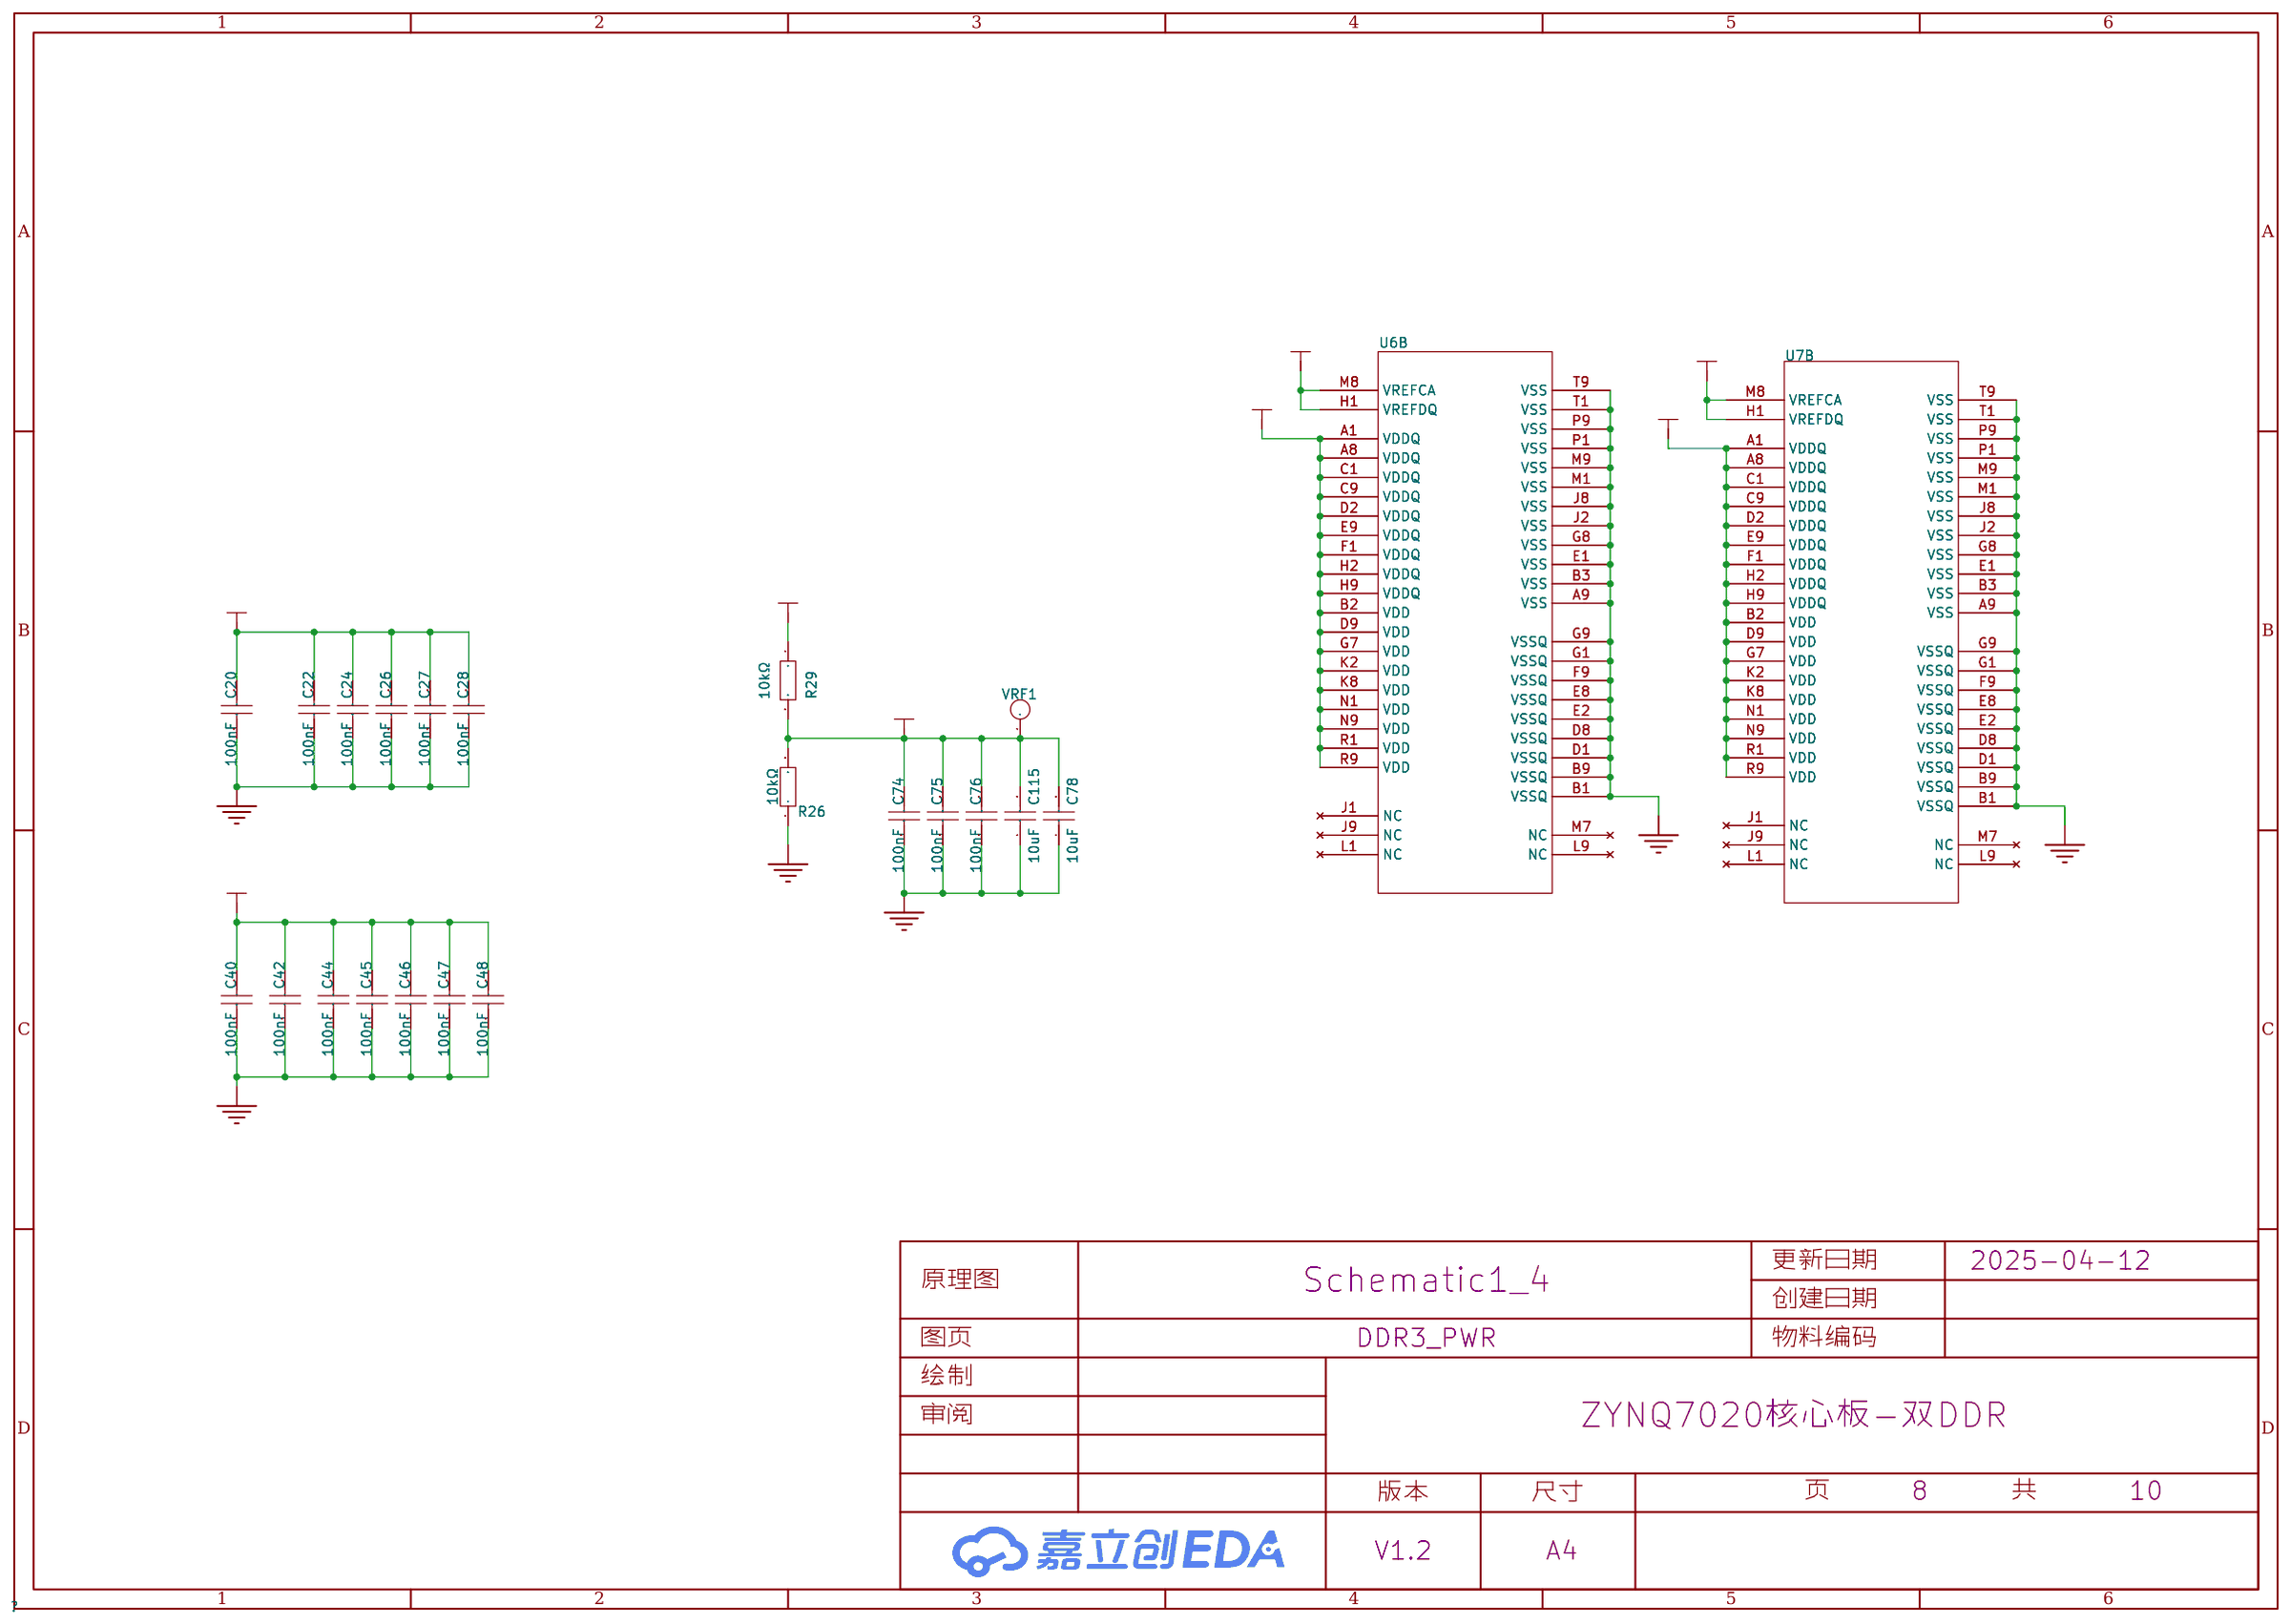
[diagram p9: DDR3_PWR]

## Parts
sheet CONNECTOR
CN1  BA41-A0BT-0-NHB  [CONN-SMD_FBB08006-F100S1013W5M]
CN2  BA41-A0BT-0-NHB  [CONN-SMD_FBB08006-F100S1013W5M]
H1  MH254RS-11-05-1000  [CONN-SMD_MH254RS-11-05-100]
sheet DDR3
R25  10kΩ  [R0402]
R27  240Ω  [R0603_1]
R28  240Ω  [R0603_1]
R109  82Ω  [R0603_1]
U6  NT5CC256M16ER-EK  [TFBGA-96_L13.0-W8.0-R16-C6-P0.80-TL]  (sections 1,2)
U7  NT5CC256M16ER-EK  [TFBGA-96_L13.0-W8.0-R16-C6-P0.80-TL]  (sections 1,2)
sheet DDR3_PWR
C20  100nF  [C0402]
C22  100nF  [C0402]
C24  100nF  [C0402]
C26  100nF  [C0402]
C27  100nF  [C0402]
C28  100nF  [C0402]
C40  100nF  [C0402]
C42  100nF  [C0402]
C44  100nF  [C0402]
C45  100nF  [C0402]
C46  100nF  [C0402]
C47  100nF  [C0402]
C48  100nF  [C0402]
C74  100nF  [C0402]
C75  100nF  [C0402]
C76  100nF  [C0402]
C78  10uF  [C0402]
C115  10uF  [C0402]
R26  10kΩ  [R0402]
R29  10kΩ  [R0402]
VRF1  -  [测试点]
sheet ETHERNET
C89  100nF  [C0402]
C90  100nF  [C0402]
C102  100nF  [C0402]
C113  100nF  [C0402]
C216  100nF  [C0402]
C218  22uF  [C0603]
C219  100nF  [C0402]
C220  100nF  [C0402]
C221  100nF  [C0402]
C223  22uF  [C0603]
C224  100nF  [C0402]
C225  100nF  [C0402]
R59  4.7kΩ  [R0402]
R60  2.4kΩ  [R0402]
R61  4.7kΩ  [R0402]
R62  4.7kΩ  [R0402]
R64  4.7kΩ  [R0402]
R122  0402WGF330JTCE  [R0402]
U17  RTL8211E-VB-CG  [QFN-48_L6.0-W6.0-P0.40-BL-EP3.8_WU]
sheet MEM
C71  100nF  [C0402]
C95  100nF  [C0402]
C97  100nF  [C0402]
C99  100nF  [C0402]
C108  100nF  [C0402]
C109  1uF  [C0402]
CARD1  TF-01A  [TF-SMD_TF-01A]
R12  0402WGF330JTCE  [R0402]
R13  0402WGF330JTCE  [R0402]
R14  0402WGF330JTCE  [R0402]
R15  0402WGF330JTCE  [R0402]
R16  0402WGF330JTCE  [R0402]
R17  0402WGF330JTCE  [R0402]
R90  4.7kΩ  [R0402]
R92  4.7kΩ  [R0402]
R106  0402WGF330JTCE  [R0402]
U25  W25Q256JVEIQ  [WSON-8_L8.0-W6.10-P1.27-BL-EP]
U27  KLM8G1GETF-B041  [emmc-153-deletePoint]  (sections 1,2,3)
sheet POWER
1V  -  [测试点]
1V8  -  [测试点]
1V35  -  [测试点]
3V3  -  [测试点]
5V  -  [测试点]
C1  22uF  [C0603]
C2  22uF  [C0603]
C3  22uF  [C0603]
C4  22uF  [C0603]
C5  22uF  [C0603]
C6  22uF  [C0603]
C7  22uF  [C0603]
C8  22uF  [C0603]
C9  22uF  [C0603]
C10  22uF  [C0603]
C11  22uF  [C0603]
C14  22uF  [C0603]
C15  22uF  [C0603]
C16  22uF  [C0603]
C17  22uF  [C0603]
C106  22uF  [C0603]
C110  100nF  [C0402]
C111  10nF  [C0402]
C114  220nF  [C0402]
L1  2.2uH  [IND-SMD_L2.5-W2.0]
L2  2.2uH  [IND-SMD_L2.5-W2.0]
L3  2.2uH  [IND-SMD_L2.5-W2.0]
L9  2.2uH  [IND-SMD_L2.5-W2.0]
R1  10kΩ  [R0402]
R2  10kΩ  [R0402]
R3  10kΩ  [R0402]
R5  10kΩ  [R0402]
R6  10kΩ  [R0402]
R8  10kΩ  [R0402]
R9  10kΩ  [R0402]
R100  10kΩ  [R0402]
R123  10kΩ  [R0402]
R124  6.8kΩ  [R0603]
R125  10kΩ  [R0402]
R126  2.2kΩ  [R0402]
R127  20kΩ  [R0402]
R128  10kΩ  [R0402]
R131  12kΩ  [R0402_1]
R132  15kΩ  [R0402_1]
U1  SY8003ADFC  [DFN-8_L2.0-W2.0-P0.50-LS2.0-BL-EP]
U2  SY8003ADFC  [DFN-8_L2.0-W2.0-P0.50-LS2.0-BL-EP]
U3  SY8003ADFC  [DFN-8_L2.0-W2.0-P0.50-LS2.0-BL-EP]
U23  SY8003ADFC  [DFN-8_L2.0-W2.0-P0.50-LS2.0-BL-EP]
sheet ZYNQ_FUC
C79  100nF  [C0402]
C80  100nF  [C0402]
FB1  GZ1608D601TF  [L0603]
LED1  19-217/GHC-YR1S2/3T  [LED0603-RD]
R55  4.7kΩ  [R0402]
R56  1kΩ  [R0402]
R85  0402WGF1000TCE  [R0402]
R110  4.7kΩ  [R0402]
R111  1kΩ  [R0402]
R119  0402WGF1000TCE  [R0402]
sheet ZYNQ_PL
C94  100nF  [C0402]
LED2  19-217/GHC-YR1S2/3T  [LED0603-RD]
R86  0402WGF330JTCE  [R0402]
R87  4.7kΩ  [R0402]
R88  4.7kΩ  [R0402]
X6  50MHz  [OSC-SMD_4P-L3.2-W2.5-BL]
sheet ZYNQ_PS
C65  100nF  [C0402]
C91  100nF  [C0402]
C92  100nF  [C0402]
C93  100nF  [C0402]
LED3  19-217/GHC-YR1S2/3T  [LED0603-RD]
R63  0402WGF330JTCE  [R0402]
R65  0402WGF330JTCE  [R0402]
R68  10kΩ  [R0402]
R69  10kΩ  [R0402]
R70  10kΩ  [R0402]
R71  10kΩ  [R0402]
R72  10kΩ  [R0402]
R73  10kΩ  [R0402]
R74  10kΩ  [R0402]
R75  10kΩ  [R0402]
R76  0402WGF330JTCE  [R0402]
R77  0402WGF330JTCE  [R0402]
R78  0402WGF330JTCE  [R0402]
R79  0402WGF330JTCE  [R0402]
R80  10kΩ  [R0402]
R81  10kΩ  [R0402]
R82  10kΩ  [R0402]
R83  10kΩ  [R0402]
R84  10kΩ  [R0402]
R89  4.7kΩ  [R0402]
SW1  K2-1107ST-A4DW-06  [KEY-SMD_L6.2-W3.6-LS8.0]
SW3  DSHP02TSGET  [SW-SMD_4P_DSHP02TSGET]
U29  HX811T  [SOT-143_L2.9-W1.3-P1.92-LS2.3-BL]
X5  33.333MHz  [OSC-SMD_4P-L3.2-W2.5-BL]
sheet ZYNQ_PWR
C81  100nF  [C0402_NEW]
C83  22uF  [C0603]
C84  100nF  [C0402_NEW]
C85  100nF  [C0402_NEW]
C86  100nF  [C0402_NEW]
C87  100nF  [C0402_NEW]
C104  100nF  [C0402_NEW]
C105  100nF  [C0402_NEW]
C112  100nF  [C0402_NEW]
C117  100nF  [C0402_NEW]
C118  100nF  [C0402_NEW]
C119  100nF  [C0402_NEW]
C120  100nF  [C0402_NEW]
C122  100nF  [C0402_NEW]
C123  100nF  [C0402_NEW]
C124  100nF  [C0402_NEW]
C130  100nF  [C0402_NEW]
C131  100nF  [C0402_NEW]
C132  100nF  [C0402_NEW]
C133  100nF  [C0402_NEW]
C134  100nF  [C0402_NEW]
C137  100nF  [C0402_NEW]
C140  100nF  [C0402_NEW]
C143  100nF  [C0402_NEW]
C144  100nF  [C0402_NEW]
C145  100nF  [C0402_NEW]
C146  1uF  [C0402]
C147  100nF  [C0402_NEW]
C148  100nF  [C0402_NEW]
C150  100nF  [C0402_NEW]
C157  22uF  [C0603]
C158  22uF  [C0603]
C159  22uF  [C0603]
C160  22uF  [C0603]
C161  22uF  [C0603]
C162  22uF  [C0603]
C163  22uF  [C0603]
C164  100nF  [C0402_NEW]
C165  100nF  [C0402_NEW]
C166  100nF  [C0402_NEW]
C167  100nF  [C0402_NEW]
C168  100nF  [C0402_NEW]
C169  100nF  [C0402_NEW]
C170  100nF  [C0402_NEW]
C171  100nF  [C0402_NEW]
C172  100nF  [C0402_NEW]
C173  100nF  [C0402_NEW]
C185  100nF  [C0402_NEW]
C186  100nF  [C0402_NEW]
C187  100nF  [C0402_NEW]
C188  100nF  [C0402_NEW]
C190  100nF  [C0402_NEW]
C192  100nF  [C0402_NEW]
C193  100nF  [C0402_NEW]
C205  22uF  [C0603]
C226  22uF  [C0603]
C227  1uF  [C0402]
FB2  GZ1608D601TF  [L0603]
R57  0Ω  [R0603_1]
R58  NC  [R0603_1]
R115  0Ω  [R0603_1]
R118  NC  [R0603_1]
U12  XC7Z010-1CLG400C  [FBGA-400_L17.0-W17.0-R20-C20-P0.80-TL]  (sections 1,2,3,4,5,6,7,8,9)

## Library data of the parts
CN1 CN2 = BA41-A0BT-0-NHB: LCSC Part Name: 100PIN 间距0.8mm; Supplier Part: C508661; Manufacturer: STWXE(深台帏翔); Supplier Footprint: SMD,P=0.8mm; JLCPCB Part Class: 扩展库; Datasheet: https://atta.szlcsc.com/upload/public/pdf/source/20200407/C508649_E05931DE7E447B00FC3E3B95FE6B6DE2.pdf; Supplier: LCSC
H1 = MH254RS-11-05-1000: 插针结构:1x5P;间距:2.54mm;行距:-;圆针/方针:圆针;安装方式:卧贴;排数:单排;总PIN位数:5P;额定电流:3A;额定电压:-;配合针长度:3.5mm;塑高:3mm;端接针长度:-;触头材质:-;工作温度:-40℃~+105℃;颜色:黑色;; LCSC Part Name: 1x5P 间距:2.54mm 圆针 卧贴; Supplier Part: C668123; Manufacturer: XFCN(兴飞); Supplier Footprint: SMD,P=2.54mm,卧贴; JLCPCB Part Class: 扩展库; Datasheet: https://atta.szlcsc.com/upload/public/pdf/source/20200618/C668123_4EC48CB5E934F8229270D96ED74DAD98.pdf; Supplier: LCSC; Pin Structure: 1x5P; Pitch: 2.54mm; Circluar Pins/Square Pins: 圆针; Mounting Type: 卧贴; Number of Rows: 单排; Number of Pins: 5P; Current Rating: 3A; Length of Mating Pin: 3.5mm; Insulation Height: 3mm; Operating Temperature: -40℃~+105℃; Color: 黑色
R1-R3 R5 R6 R8 R9 R25 R26 R29 R68-R75 R80-R84 R100 R123 R125 R128 = 0402WGF1002TCE: 电阻类型:厚膜电阻;阻值:10kΩ;精度:±1%;功率:62.5mW;温度系数:±100ppm/℃;最大工作电压:50V;工作温度范围:-55℃~+155℃;; LCSC Part Name: 10kΩ ±1% 62.5mW; Supplier Part: C25744; Manufacturer: UNI-ROYAL(厚声); Supplier Footprint: 0402; JLCPCB Part Class: 基础库; Datasheet: https://atta.szlcsc.com/upload/public/pdf/source/20200306/C422600_1E6D84923E4A46A82E41ADD87F860B5C.pdf; Supplier: LCSC; Type: 厚膜电阻; Tolerance: ±1%; Power(Watts): 62.5mW; Temperature Coefficient: ±100ppm/℃; Overload Voltage (Max): 50V; Operating Temperature Range: -55℃~+155℃
R27 R28 = 0603WAF2400T5E: 电阻类型:厚膜电阻;阻值:240Ω;精度:±1%;功率:100mW;温度系数:±100ppm/℃;最大工作电压:75V;工作温度范围:-55℃~+155℃;; LCSC Part Name: 240Ω ±1% 100mW; Supplier Part: C23350; Manufacturer: UNI-ROYAL(厚声); Supplier Footprint: 0603; JLCPCB Part Class: 基础库; Datasheet: https://atta.szlcsc.com/upload/public/pdf/source/20200306/C422600_1E6D84923E4A46A82E41ADD87F860B5C.pdf; Supplier: LCSC; Type: 厚膜电阻; Tolerance: ±1%; Power(Watts): 100mW; Temperature Coefficient: ±100ppm/℃; Overload Voltage (Max): 75V; Operating Temperature Range: -55℃~+155℃
R109 = 0603WAF820JT5E: 电阻类型:厚膜电阻;阻值:82Ω;精度:±1%;功率:100mW;温度系数:±100ppm/℃;最大工作电压:75V;工作温度范围:-55℃~+155℃;; LCSC Part Name: 82Ω ±1% 100mW; Supplier Part: C23255; Manufacturer: UNI-ROYAL(厚声); Supplier Footprint: 0603; JLCPCB Part Class: 基础库; Datasheet: https://atta.szlcsc.com/upload/public/pdf/source/20200306/C422600_1E6D84923E4A46A82E41ADD87F860B5C.pdf; Supplier: LCSC; Type: 厚膜电阻; Tolerance: ±1%; Power(Watts): 100mW; Temperature Coefficient: ±100ppm/℃; Overload Voltage (Max): 75V; Operating Temperature Range: -55℃~+155℃
U6 U7 = NT5CC256M16ER-EK: Supplier Part: C428584; Manufacturer: Nanya(南亚科技); Supplier Footprint: TFBGA-96; JLCPCB Part Class: 扩展库; Datasheet: https://atta.szlcsc.com/upload/public/pdf/source/20190912/C428584_C33860C5A34E1626944F37A05F9FF64A.pdf; Supplier: LCSC
C20 C22 C24 C26-C28 C40 C42 C44-C48 C65 C71 C74-C76 C79 C80 C89-C95 C97 C99 C102 C108 C110 C113 C216 C219-C221 C224 C225 = CL05B104KO5NNNC: 容值:100nF;精度:±10%;额定电压:16V;材质(温度系数):X7R;; LCSC Part Name: 100nF ±10% 16V; Supplier Part: C1525; Manufacturer: SAMSUNG(三星); Supplier Footprint: 0402; JLCPCB Part Class: Basic Part; Datasheet: https://atta.szlcsc.com/upload/public/pdf/source/20160218/1457707763339.pdf; Supplier: LCSC; Tolerance: ±10%; Voltage Rated: 16V; Temperature Coefficient: X7R
C78 C115 = CL05A106MQ5NUNC: 容值:10uF;精度:±20%;额定电压:6.3V;材质(温度系数):X5R;; LCSC Part Name: 10uF ±20% 6.3V; Supplier Part: C15525; Manufacturer: SAMSUNG(三星); Supplier Footprint: 0402; JLCPCB Part Class: 基础库; Datasheet: https://atta.szlcsc.com/upload/public/pdf/source/20220823/2B02EE04F8F211D38A52DCB16EB6BEBA.pdf; Supplier: LCSC; Tolerance: ±20%; Voltage Rated: 6.3V; Temperature Coefficient: X5R
1V 1V8 1V35 3V3 5V VRF1 = 测试点
C1-C11 C14-C17 C83 C106 C157-C163 C205 C218 C223 C226 = CL10A226MQ8NRNC: 容值:22uF;精度:±20%;额定电压:6.3V;材质(温度系数):X5R;; LCSC Part Name: 22uF ±20% 6.3V; Supplier Part: C59461; Manufacturer: SAMSUNG(三星); Supplier Footprint: 0603; JLCPCB Part Class: 基础库; Datasheet: https://atta.szlcsc.com/upload/public/pdf/source/20160103/1457707740762.pdf; Supplier: LCSC; Tolerance: ±20%; Voltage Rated: 6.3V; Temperature Coefficient: X5R
R55 R59 R61 R62 R64 R87-R90 R92 R110 = 0402WGF4701TCE: 功率:1/16W;精度:±1%;阻值:4.7kΩ;温度系数:±100ppm/℃;最大工作电压:50V;工作温度范围:-55℃~+155℃;; LCSC Part Name: 4.7KΩ ±1%; Supplier Part: C25900; Manufacturer: UNI-ROYAL(厚声); Supplier Footprint: 0402; JLCPCB Part Class: 基础库; Datasheet: https://atta.szlcsc.com/upload/public/pdf/source/20170920/C25900_1505895105102980906.pdf; Supplier: LCSC; Power(Watts): 1/16W; Tolerance: ±1%; Temperature Coefficient: ±100ppm/℃; Overload Voltage (Max): 50V; Operating Temperature Range: -55℃~+155℃
R60 = 0402WGF2401TCE: 阻值:2.4kΩ;精度:±1%;功率:1/16W;温度系数:±100ppm/℃;最大工作电压:50V;工作温度范围:-55℃~+155℃;; LCSC Part Name: 2.4KΩ ±1%; Supplier Part: C25882; Manufacturer: UNI-ROYAL(厚声); Supplier Footprint: 0402; JLCPCB Part Class: Basic Part; Datasheet: https://atta.szlcsc.com/upload/public/pdf/source/20170920/C25882_1505895096979980888.pdf; Supplier: LCSC; Tolerance: ±1%; Power(Watts): 1/16W; Temperature Coefficient: ±100ppm/℃; Overload Voltage (Max): 50V; Operating Temperature Range: -55℃~+155℃
R12-R17 R63 R65 R76-R79 R86 R106 R122 = 0402WGF330JTCE: 33Ω; LCSC Part Name: 33Ω(33R0) ±1% 编带; Supplier Part: C25105; Manufacturer: UNI-ROYAL(厚声); Supplier Footprint: 0402; JLCPCB Part Class: 基础库; Datasheet: https://atta.szlcsc.com/upload/public/pdf/source/20170920/C25105_1505901212922982736.pdf; Supplier: LCSC
U17 = RTL8211E-VB-CG: Supplier: LCSC; Manufacturer: REALTEK; Supplier Part: C90735; JLCPCB Part Class: Extended Part
C109 C146 C227 = CL05A105KA5NQNC: 容值:1uF;精度:±10%;额定电压:25V;材质(温度系数):X5R;; LCSC Part Name: 1uF ±10% 25V; Supplier Part: C52923; Manufacturer: SAMSUNG(三星); Supplier Footprint: 0402; JLCPCB Part Class: 基础库; Datasheet: https://atta.szlcsc.com/upload/public/pdf/source/20160103/1457707735223.pdf; Supplier: LCSC; Tolerance: ±10%; Voltage Rated: 25V; Temperature Coefficient: X5R
CARD1 = TF-01A: Supplier: LCSC; Manufacturer: HRO; Supplier Part: C91145; JLCPCB Part Class: Extended Part
U25 = W25Q256JVEIQ_C97522: Supplier Part: C97522; Manufacturer: WINBOND(华邦); Supplier Footprint: WSON-8-EP(6.1x8); JLCPCB Part Class: 扩展库; Datasheet: https://atta.szlcsc.com/upload/public/pdf/source/20190529/C97522_47AE152D0BB11FB4C8509E398C0AD2EA.pdf; Supplier: LCSC
U27 = KLM8G1GETF-B041: Supplier Part: C499918; Manufacturer: SAMSUNG(三星半导体); Supplier Footprint: FBGA; JLCPCB Part Class: 扩展库; Datasheet: https://atta.szlcsc.com/upload/public/pdf/source/20200730/C499918_BA626D9A4952A33A6B491C88DA3C2D72.pdf; Supplier: LCSC
C111 = CL05B103KB5NNNC: 容值:10nF;精度:±10%;额定电压:50V;材质(温度系数):X7R;; LCSC Part Name: 10nF ±10% 50V; Supplier Part: C15195; Manufacturer: SAMSUNG(三星); Supplier Footprint: 0402; JLCPCB Part Class: 基础库; Datasheet: https://atta.szlcsc.com/upload/public/pdf/source/20160103/1457707674468.pdf; Supplier: LCSC; Tolerance: ±10%; Voltage Rated: 50V; Temperature Coefficient: X7R
C114 = CL05B224KO5NNNC: 容值:220nF;精度:±10%;额定电压:16V;材质(温度系数):X7R;; LCSC Part Name: 220nF ±10% 16V; Supplier Part: C16772; Manufacturer: SAMSUNG(三星); Supplier Footprint: 0402; JLCPCB Part Class: 基础库; Datasheet: https://atta.szlcsc.com/upload/public/pdf/source/20160103/1457707689724.pdf; Supplier: LCSC; Tolerance: ±10%; Voltage Rated: 16V; Temperature Coefficient: X7R
L1-L3 L9 = 252012CDMCDDS-2R2MC: 电感值:2.2uH;精度:±20%;额定电流:3A;直流电阻(DCR):68mΩ;; LCSC Part Name: 2.2uH ±20% 3A 68mΩ; Supplier Part: C351245; Manufacturer: Sumida(胜美达); Supplier Footprint: SMD; JLCPCB Part Class: 扩展库; Datasheet: https://atta.szlcsc.com/upload/public/pdf/source/20181218/C351245_E4468C65CBAE3BB79EEE310C94A8202E.pdf; Supplier: LCSC; Tolerance: ±20%; Rated Current: 3A; DC Resistance (DCR): 68mΩ
R124 = 0603WAF6801T5E: 电阻类型:厚膜电阻;阻值:6.8kΩ;精度:±1%;功率:100mW;最大工作电压:75V;温度系数:±100ppm/℃;; LCSC Part Name: 6.8kΩ ±1% 100mW 厚膜电阻; Supplier Part: C23212; Manufacturer: UNI-ROYAL(厚声); Supplier Footprint: 0603; JLCPCB Part Class: 基础库; Datasheet: https://atta.szlcsc.com/upload/public/pdf/source/20200306/C422600_1E6D84923E4A46A82E41ADD87F860B5C.pdf; Supplier: LCSC; Type: 厚膜电阻; Tolerance: ±1%; Power(Watts): 100mW; Overload Voltage (Max): 75V; Temperature Coefficient: ±100ppm/℃; Operating Temperature Range: -55℃~+155℃
R126 = 0402WGF2201TCE: 电阻类型:厚膜电阻;阻值:2.2kΩ;精度:±1%;功率:62.5mW;最大工作电压:50V;温度系数:±100ppm/℃;; LCSC Part Name: 2.2kΩ ±1% 62.5mW 厚膜电阻; Supplier Part: C25879; Manufacturer: UNI-ROYAL(厚声); Supplier Footprint: 0402; JLCPCB Part Class: 基础库; Datasheet: https://atta.szlcsc.com/upload/public/pdf/source/20200306/C422600_1E6D84923E4A46A82E41ADD87F860B5C.pdf; Supplier: LCSC; Type: 厚膜电阻; Tolerance: ±1%; Power(Watts): 62.5mW; Overload Voltage (Max): 50V; Temperature Coefficient: ±100ppm/℃; Operating Temperature Range: -55℃~+155℃
R127 = 0402WGF2002TCE: 电阻类型:厚膜电阻;阻值:20kΩ;精度:±1%;功率:62.5mW;温度系数:±100ppm/℃;最大工作电压:50V;工作温度范围:-55℃~+155℃;; LCSC Part Name: 20kΩ ±1% 62.5mW; Supplier Part: C25765; Manufacturer: UNI-ROYAL(厚声); Supplier Footprint: 0402; JLCPCB Part Class: 基础库; Datasheet: https://atta.szlcsc.com/upload/public/pdf/source/20200306/C422600_1E6D84923E4A46A82E41ADD87F860B5C.pdf; Supplier: LCSC; Type: 厚膜电阻; Tolerance: ±1%; Power(Watts): 62.5mW; Temperature Coefficient: ±100ppm/℃; Overload Voltage (Max): 50V; Operating Temperature Range: -55℃~+155℃
R131 = 0402WGF1202TCE: 电阻类型:厚膜电阻;阻值:12kΩ;精度:±1%;功率:62.5mW;最大工作电压:50V;温度系数:±100ppm/℃;; LCSC Part Name: 12kΩ ±1% 62.5mW 厚膜电阻; Supplier Part: C25752; Manufacturer: UNI-ROYAL(厚声); Supplier Footprint: 0402; JLCPCB Part Class: 基础库; Datasheet: https://atta.szlcsc.com/upload/public/pdf/source/20200306/C422600_1E6D84923E4A46A82E41ADD87F860B5C.pdf; Supplier: LCSC; Type: 厚膜电阻; Tolerance: ±1%; Power(Watts): 62.5mW; Overload Voltage (Max): 50V; Temperature Coefficient: ±100ppm/℃; Operating Temperature Range: -55℃~+155℃
R132 = 0402WGF1502TCE: 电阻类型:厚膜电阻;阻值:15kΩ;精度:±1%;功率:62.5mW;最大工作电压:50V;温度系数:±100ppm/℃;; LCSC Part Name: 15kΩ ±1% 62.5mW 厚膜电阻; Supplier Part: C25756; Manufacturer: UNI-ROYAL(厚声); Supplier Footprint: 0402; JLCPCB Part Class: 基础库; Datasheet: https://atta.szlcsc.com/upload/public/pdf/source/20200306/C422600_1E6D84923E4A46A82E41ADD87F860B5C.pdf; Supplier: LCSC; Type: 厚膜电阻; Tolerance: ±1%; Power(Watts): 62.5mW; Overload Voltage (Max): 50V; Temperature Coefficient: ±100ppm/℃; Operating Temperature Range: -55℃~+155℃
U1-U3 U23 = SY8003ADFC: 功能类型:降压型;同步整流:是;输出通道数:1;拓扑结构:降压式;输入电压:2.7V~5V;输出电流(最大值):3A;开关频率:1MHz;静态电流(Iq):-;工作温度:-40℃~+85℃@(Ta);; LCSC Part Name: 降压型 Vin=2.7V~5V 3A; Supplier Part: C178236; Manufacturer: silergy(矽力杰); Supplier Footprint: DFN-8(2x2); JLCPCB Part Class: 扩展库; Datasheet: https://atta.szlcsc.com/upload/public/pdf/source/20180301/C178236_15198943889691383935.pdf; Supplier: LCSC; Function: 降压型; Synchronous Rectification: 是; Number of Outputs: 1; Topology: 降压式; Input Voltage: 2.7V~5V; Output Current (Max): 3A; Switching Frequency: 1MHz; Operating Temperature: -40℃~+85℃@(Ta)
FB1 FB2 = GZ1608D601TF: 标称阻抗@测试频率:600Ω@100MHz;误差:±25%;直流电阻(RDC):450mΩ;额定电流:200mA;电路数:1;; LCSC Part Name: 600Ω@100MHz ±25%; Supplier Part: C1002; Manufacturer: Sunlord(顺络); Supplier Footprint: SMD; JLCPCB Part Class: 基础库; Datasheet: https://atta.szlcsc.com/upload/public/pdf/source/20210830/355EA7C0FAC5394FC0FE3F17C770C20A.pdf; Supplier: LCSC; Impedance @ Frequency: 600Ω@100MHz; Tolerance: ±25%; DC Resistance: 450mΩ; Current Rating: 200mA; Circuits: 1
LED1-LED3 = 19-217/GHC-YR1S2/3T: 发光颜色:翠绿色;正向电压(VF):3.3V;功率:110mW;正向电流:20mA;主波长:520nm~535nm;二极管配置:-;透镜颜色:无色透明透镜;色温:-;发光强度:199mcd;发光角度:120°;载带方式:-;工作温度:-40℃~+85℃;; LCSC Part Name: 翠绿 停产; Supplier Part: C72043; Manufacturer: EVERLIGHT(亿光); Supplier Footprint: 0603; JLCPCB Part Class: Extended Part; Datasheet: https://atta.szlcsc.com/upload/public/pdf/source/20160507/1462613613780.pdf; Supplier: LCSC; Emitted Color: 翠绿色; Forward Voltage (VF): 3.3V; Power Dissipation: 110mW; Forward Current: 20mA; Dominant Wavelength: 520nm~535nm; Peak Wavelength: 518nm; Lens Color: 无色透明透镜; Luminous Intensity: 199mcd; Viewing Angle: 120°; Operating Temperature: -40℃~+85℃
R56 R111 = 0402WGF1001TCE: 电阻类型:厚膜电阻;阻值:1kΩ;精度:±1%;功率:62.5mW;温度系数:±100ppm/℃;最大工作电压:50V;工作温度范围:-55℃~+155℃;; LCSC Part Name: 1kΩ ±1% 62.5mW; Supplier Part: C11702; Manufacturer: UNI-ROYAL(厚声); Supplier Footprint: 0402; JLCPCB Part Class: 基础库; Datasheet: https://atta.szlcsc.com/upload/public/pdf/source/20200306/C422600_1E6D84923E4A46A82E41ADD87F860B5C.pdf; Supplier: LCSC; Type: 厚膜电阻; Tolerance: ±1%; Power(Watts): 62.5mW; Temperature Coefficient: ±100ppm/℃; Overload Voltage (Max): 50V; Operating Temperature Range: -55℃~+155℃
R85 R119 = 0402WGF1000TCE: LCSC Part Name: 100Ω; Supplier Part: C25076; Manufacturer: UNI-ROYAL(厚声); Supplier Footprint: 0402; JLCPCB Part Class: 基础库; Datasheet: https://atta.szlcsc.com/upload/public/pdf/source/20170920/C25076_1505901197574982707.pdf; Supplier: LCSC
X6 = TFOM50M4RHKCNT2T: 频率:50MHz;频率稳定度:±50ppm;工作电压:1.8V~5V;供电电流:25mA;输出模式:CMOS;工作温度:-40℃~+85℃;车规等级:-;; LCSC Part Name: 50MHz ±50ppm 1.8V~5V CMOS; Supplier Part: C454615; Manufacturer: TAE(雅晶鑫); Supplier Footprint: SMD3225-4P; JLCPCB Part Class: 扩展库; Datasheet: https://atta.szlcsc.com/upload/public/pdf/source/20191113/C454615_7499FE715382987840C1107E5C8EE924.pdf; Supplier: LCSC; Frequency Stability: ±50ppm; Supply Voltage: 1.8V~5V; Supply Current (Max): 25mA; Output Type: CMOS; Operating Temperature: -40℃~+85℃
SW1 = K2-1107ST-A4DW-06_C118141: 触点电流:50mA;额定电压(DC):12V;绝缘电阻:100MΩ;电路结构:单刀单掷;安装方式:立贴;按钮形状:矩形按钮;带灯:-;作用力:250gf@±30gf;机械寿命:100000;工作温度:-25℃~+85℃;开关长度:6.1mm;开关宽度:3.6mm;开关高度:2.5mm;; LCSC Part Name: 轻触开关 3.6*6.1*2.5; Supplier Part: C118141; Manufacturer: 韩国韩荣; Supplier Footprint: SMD; JLCPCB Part Class: 扩展库; Datasheet: https://atta.szlcsc.com/upload/public/pdf/source/20210810/381712CEF248770C072B585C3485C888.pdf; Supplier: LCSC; Contact Current: 50mA; Voltage Rating (DC): 12V; Insulation Resistance: 100MΩ; Circuit: 单刀单掷; Mounting Style: 立贴; Actuator Style: 矩形按钮; Operating Force: 250gf@±30gf; Mechanical Life: 100000; Operating Temperature: -25℃~+85℃; Switch Length: 6.1mm; Switch Width: 3.6mm; Switch Height: 2.5mm
SW3 = DSHP02TSGET: 类型:平拨，凹槽式;电路结构:单刀单掷;开关位数:2;引脚间距:1.27mm;颜色:黑色;; LCSC Part Name: 2位 1.27间距; Supplier Part: C40735; Manufacturer: YE; Supplier Footprint: SMD-4P,5.4x4.14mm; JLCPCB Part Class: 扩展库; Datasheet: https://atta.szlcsc.com/upload/public/pdf/source/20150928/1457707425261.pdf; Supplier: LCSC; Type: 平拨，凹槽式; Circuit: 单刀单掷; Number of Positions: 2; Lead Pitch: 1.27mm; Color: 黑色
U29 = HX811T: LCSC Part Name: 检测复位IC  HX811T; Supplier Part: C296128; Manufacturer: HX(恒佳兴); Supplier Footprint: SOT-143; JLCPCB Part Class: 扩展库; Datasheet: https://atta.szlcsc.com/upload/public/pdf/source/20181119/C296128_6509B37C6407C6FF929C4891EE243D12.pdf; Supplier: LCSC
X5 = S3D33.333000B20F30T: 频率:33.333MHz;频率稳定度:±20ppm;工作电压:3.3V;供电电流:20mA;工作温度:-40℃~+85℃;; LCSC Part Name: 33.333MHz ±20ppm 3.3V; Supplier Part: C387421; Manufacturer: SCTF(星通时频); Supplier Footprint: SMD3225-4P; JLCPCB Part Class: 扩展库; Datasheet: https://atta.szlcsc.com/upload/public/pdf/source/20190605/C387421_11B35265D3569EDB6CE9EFC1D7E7AB04.pdf; Supplier: LCSC; Frequency Stability: ±20ppm; Supply Voltage: 3.3V; Supply Current (Max): 20mA; Operating Temperature: -40℃~+85℃
C81 C84-C87 C104 C105 C112 C117-C120 C122-C124 C130-C134 C137 C140 C143-C145 C147 C148 C150 C164-C173 C185-C188 C190 C192 C193 = CL05B104KO5NNNC: 容值:100nF;精度:±10%;额定电压:16V;材质(温度系数):X7R;; LCSC Part Name: 100nF ±10% 16V; Supplier Part: C1525; Manufacturer: SAMSUNG(三星); Supplier Footprint: 0402; JLCPCB Part Class: 基础库; Datasheet: https://atta.szlcsc.com/upload/public/pdf/source/20160103/1457707674891.pdf; Supplier: LCSC; Tolerance: ±10%; Voltage Rated: 16V; Temperature Coefficient: X7R
R57 R115 = 0603WAF0000T5E: 电阻类型:厚膜电阻;阻值:0Ω;精度:±1%;功率:100mW;最大工作电压:75V;工作温度范围:-55℃~+155℃;; LCSC Part Name: 0Ω ±1% 100mW; Supplier Part: C21189; Manufacturer: UNI-ROYAL(厚声); Supplier Footprint: 0603; JLCPCB Part Class: 基础库; Datasheet: https://atta.szlcsc.com/upload/public/pdf/source/20200306/C422600_1E6D84923E4A46A82E41ADD87F860B5C.pdf; Supplier: LCSC; Type: 厚膜电阻; Tolerance: ±1%; Power(Watts): 100mW; Overload Voltage (Max): 75V; Operating Temperature Range: -55℃~+155℃
R58 R118 = 0603WAF1003T5E: 电阻类型:厚膜电阻;阻值:100kΩ;精度:±1%;功率:100mW;温度系数:±100ppm/℃;最大工作电压:75V;工作温度范围:-55℃~+155℃;; LCSC Part Name: 100kΩ ±1% 100mW; Supplier Part: C25803; Manufacturer: UNI-ROYAL(厚声); Supplier Footprint: 0603; JLCPCB Part Class: 基础库; Datasheet: https://atta.szlcsc.com/upload/public/pdf/source/20200306/C422600_1E6D84923E4A46A82E41ADD87F860B5C.pdf; Supplier: LCSC; Type: 厚膜电阻; Tolerance: ±1%; Power(Watts): 100mW; Temperature Coefficient: ±100ppm/℃; Overload Voltage (Max): 75V; Operating Temperature Range: -55℃~+155℃
U12 = XC7Z010-1CLG400C_C2843417: Supplier Part: C2843417; Manufacturer: XILINX(赛灵思); Supplier Footprint: CSPBGA-400; JLCPCB Part Class: 扩展库; Datasheet: https://atta.szlcsc.com/upload/public/pdf/source/20191108/C446028_7ED8319F1F88212BA1E5D387DA4ECDB9.pdf; Supplier: LCSC

## Nets
1V0: 1V.1 C1.2 C2.2 C3.2 C89.1 C90.1 C102.1 C113.1 C164.1 C165.1 C166.1 C167.1 C168.1 C169.1 C170.1 C171.1 C172.1 C173.1 C216.1 C218.2 C226.2 L9.2 R124.2 U12.G7(VCCPINT) U12.G11(VCCBRAM) U12.G13(VCCINT) U12.H10(VCCBRAM) U12.H12(VCCINT) U12.J7(VCCPINT) U12.J13(VCCINT) U12.K12(VCCINT) U12.L7(VCCPINT) U12.L13(VCCINT) U12.M12(VCCINT) U12.N7(VCCPINT) U12.N13(VCCINT) U12.P8(VCCPINT) U12.P12(VCCINT) U12.R7(VCCPINT) U12.R13(VCCINT) U17.3(AVDD10) U17.9(AVDD10) U17.28(DVDD10) U17.36(DVDD10) U17.40(AVDD10)
1V8: 1V8.1 C5.2 C6.2 C7.2 C79.1 C147.1 C148.1 C150.1 C162.2 C185.1 C186.1 C187.1 C188.1 C190.1 C192.1 C193.1 C205.2 FB1.2 FB2.2 L1.2 R58.1 R118.1 R127.2 U12.F8(VCCPAUX) U12.F11(VCCBATT_0) U12.G9(VCCPAUX) U12.H8(VCCPAUX) U12.J11(VCCAUX) U12.K8(VCCPAUX) U12.L11(VCCAUX) U12.M8(VCCPAUX) U12.N9(VCCAUX) U12.N11(VCCAUX) U12.P10(VCCAUX) U12.R9(VCCAUX)
1V35: 1V35.1 C9.2 C10.2 C11.2 C20.1 C22.1 C24.1 C26.1 C27.1 C28.1 C40.1 C42.1 C44.1 C45.1 C46.1 C47.1 C48.1 C130.1 C131.1 C132.1 C133.1 C134.1 C137.1 C140.1 C160.2 L2.2 R29.1 R85.2 R132.2 U6.A1(VDDQ) U6.A8(VDDQ) U6.B2(VDD) U6.C1(VDDQ) U6.C9(VDDQ) U6.D2(VDDQ) U6.D9(VDD) U6.E9(VDDQ) U6.F1(VDDQ) U6.G7(VDD) U6.H2(VDDQ) U6.H9(VDDQ) U6.K2(VDD) U6.K8(VDD) U6.N1(VDD) U6.N9(VDD) U6.R1(VDD) U6.R9(VDD) U7.A1(VDDQ) U7.A8(VDDQ) U7.B2(VDD) U7.C1(VDDQ) U7.C9(VDDQ) U7.D2(VDDQ) U7.D9(VDD) U7.E9(VDDQ) U7.F1(VDDQ) U7.G7(VDD) U7.H2(VDDQ) U7.H9(VDDQ) U7.K2(VDD) U7.K8(VDD) U7.N1(VDD) U7.N9(VDD) U7.R1(VDD) U7.R9(VDD) U12.A3(VCCO_DDR_502) U12.D2(VCCO_DDR_502) U12.E5(VCCO_DDR_502) U12.G1(VCCO_DDR_502) U12.H4(VCCO_DDR_502) U12.L3(VCCO_DDR_502) U12.P2(VCCO_DDR_502) U12.R5(VCCO_DDR_502) U12.U1(VCCO_DDR_502) U12.V4(VCCO_DDR_502)
3V3: 3V3.1 C15.2 C16.2 C17.2 C71.1 C91.2 C92.2 C95.2 C97.1 C99.1 C119.1 C120.1 C122.1 C123.1 C124.1 C143.1 C146.2 C159.2 C161.2 C219.1 C220.1 C221.1 C223.2 C224.1 C225.1 C227.2 CARD1.4(VDD) L3.2 R16.2 R55.2 R57.1 R59.2 R61.1 R62.1 R64.1 R70.2 R71.2 R72.2 R74.1 R75.1 R84.2 R90.2 R92.2 R110.2 R111.1 R115.1 R125.1 U12.A13(VCCO_MIO1_501) U12.B6(VCCO_MIO0_500) U12.B16(VCCO_MIO1_501) U12.C19(VCCO_35) U12.D7(VCCO_MIO0_500) U12.D12(VCCO_MIO1_501) U12.E15(VCCO_MIO1_501) U12.F18(VCCO_35) U12.H14(VCCO_35) U12.J17(VCCO_35) U12.K6(VCCO_0) U12.K20(VCCO_35) U12.M6(CFGBVS_0) U12.M16(VCCO_35) U12.N6(RSVDVCC3) U12.R6(RSVDVCC2) U12.T6(RSVDVCC1) U17.6(AVDD33) U17.15(DVDD33) U17.21(DVDD33) U17.37(DVDD33) U17.41(AVDD33) U25.8(VCC) U27.C6(VDD) U27.E6(VDDF) U27.F5(VDDF) U27.J10(VDDF) U27.K9(VDDF) U27.M4(VDD) U27.N4(VDD) U27.P3(VDD) U27.P5(VDD) U29.4(VCC) X5.1(EN) X5.4(VDD)
5V0: 5V.1 C4.2 C8.2 C14.2 C106.2 CN2.1 CN2.2 CN2.3 CN2.4 CN2.5 CN2.6 CN2.7 CN2.8 R1.2 R2.2 R3.2 R5.2 R6.2 R8.2 R9.2 R100.2 U1.3(IN) U2.3(IN) U3.3(IN) U23.3(IN)
GND: C1.1 C2.1 C3.1 C4.1 C5.1 C6.1 C7.1 C8.1 C9.1 C10.1 C11.1 C14.1 C15.1 C16.1 C17.1 C20.2 C22.2 C24.2 C26.2 C27.2 C28.2 C40.2 C42.2 C44.2 C45.2 C46.2 C47.2 C48.2 C65.2 C71.2 C74.2 C75.2 C76.2 C78.1 C79.2 C80.1 C81.1 C83.1 C84.2 C85.2 C86.2 C87.2 C89.2 C90.2 C91.1 C92.1 C93.2 C94.1 C95.1 C97.2 C99.2 C102.2 C104.2 C105.2 C106.1 C108.2 C109.1 C110.1 C111.1 C112.2 C113.2 C114.1 C115.1 C117.2 C118.2 C119.2 C120.2 C122.2 C123.2 C124.2 C130.2 C131.2 C132.2 C133.2 C134.2 C137.2 C140.2 C143.2 C144.2 C145.2 C146.1 C147.2 C148.2 C150.2 C157.1 C158.1 C159.1 C160.1 C161.1 C162.1 C163.1 C164.2 C165.2 C166.2 C167.2 C168.2 C169.2 C170.2 C171.2 C172.2 C173.2 C185.2 C186.2 C187.2 C188.2 C190.2 C192.2 C193.2 C205.1 C216.2 C218.1 C219.2 C220.2 C221.2 C223.1 C224.2 C225.2 C226.1 C227.1 CARD1.6(VSS) CARD1.10(GND) CARD1.11(GND) CARD1.12(GND) CARD1.13(GND) CN1.11 CN1.12 CN1.62 CN1.63 CN1.76 CN1.77 CN1.78 CN1.79 CN1.80 CN1.81 CN1.82 CN1.83 CN1.84 CN1.85 CN1.86 CN1.88 CN2.19 CN2.34 CN2.41 CN2.52 CN2.59 CN2.70 CN2.93 CN2.94 CN2.95 CN2.96 CN2.97 CN2.98 CN2.99 CN2.100 H1.5 LED2.1(C) LED3.1(C) R25.1 R26.1 R27.2 R28.2 R56.2 R60.1 R73.1 R80.2 R81.2 R82.2 R83.2 R87.2 R119.2 R123.1 R126.2 R128.1 R131.2 SW1.1 SW3.1(A1) SW3.2(A2) U1.4(PGND) U1.8(SGND) U1.9(PGND) U2.4(PGND) U2.8(SGND) U2.9(PGND) U3.4(PGND) U3.8(SGND) U3.9(PGND) U6.A9(VSS) U6.B1(VSSQ) U6.B3(VSS) U6.B9(VSSQ) U6.D1(VSSQ) U6.D8(VSSQ) U6.E1(VSS) U6.E2(VSSQ) U6.E8(VSSQ) U6.F9(VSSQ) U6.G1(VSSQ) U6.G8(VSS) U6.G9(VSSQ) U6.J2(VSS) U6.J8(VSS) U6.M1(VSS) U6.M9(VSS) U6.P1(VSS) U6.P9(VSS) U6.T1(VSS) U6.T9(VSS) U7.A9(VSS) U7.B1(VSSQ) U7.B3(VSS) U7.B9(VSSQ) U7.D1(VSSQ) U7.D8(VSSQ) U7.E1(VSS) U7.E2(VSSQ) U7.E8(VSSQ) U7.F9(VSSQ) U7.G1(VSSQ) U7.G8(VSS) U7.G9(VSSQ) U7.J2(VSS) U7.J8(VSS) U7.M1(VSS) U7.M9(VSS) U7.P1(VSS) U7.P9(VSS) U7.T1(VSS) U7.T9(VSS) U12.A8(GND) U12.A18(GND) U12.B1(GND) U12.B11(GND) U12.C4(GND) U12.C9(GND) U12.C14(GND) U12.D17(GND) U12.E10(GND) U12.E20(GND) U12.F3(GND) U12.F7(GND) U12.F10(RSVDGND) U12.G10(GND) U12.G12(GND) U12.G16(GND) U12.H7(GND) U12.H9(GND) U12.H11(GND) U12.H13(GND) U12.H19(GND) U12.J2(GND) U12.J8(GND) U12.J10(GNDADC_0) U12.J12(GND) U12.K5(GND) U12.K7(GND) U12.K10(VREFN_0) U12.K11(GND) U12.K13(GND) U12.K15(GND) U12.L8(GND) U12.L9(VREFP_0) U12.L12(GND) U12.L18(GND) U12.M1(GND) U12.M7(GND) U12.M9(DXP_0) U12.M10(DXN_0) U12.M11(GND) U12.M13(GND) U12.N4(GND) U12.N8(GND) U12.N10(GND) U12.N12(GND) U12.N14(GND) U12.P7(GND) U12.P9(GND) U12.P11(GND) U12.P13(GND) U12.P17(GND) U12.R8(GND) U12.R12(GND) U12.R20(GND) U12.T3(GND) U12.T7(GND) U12.T13(GND) U12.U6(GND) U12.U16(GND) U12.V9(GND) U12.V19(GND) U12.W2(GND) U12.W12(GND) U12.Y5(GND) U12.Y15(GND) U17.38(ENSWREG) U17.47(GND) U17.49(EPAD) U23.4(PGND) U23.8(SGND) U23.9(PGND) U25.4(GND) U25.9(EP) U27.A6(VSS) U27.C4(VSS) U27.E7(VSS) U27.G5(VSS) U27.H10(VSS) U27.J5(VSS) U27.K8(VSS) U27.N2(VSS) U27.N5(VSS) U27.P4(VSS) U27.P6(VSS) U29.1(GND) X5.2(GND) X6.2(GND)
BK13_T5: CN2.90 U12.T5(IO_L19P_T3_13)
BK13_T9: CN2.74 U12.T9(IO_L12P_T1_MRCC_13)
BK13_U5: CN2.88 U12.U5(IO_L19N_T3_VREF_13)
BK13_U7: CN2.86 U12.U7(IO_L11P_T1_SRCC_13)
BK13_U8: CN2.78 U12.U8(IO_L17N_T2_13)
BK13_U9: CN2.76 U12.U9(IO_L17P_T2_13)
BK13_U10: CN2.72 U12.U10(IO_L12N_T1_MRCC_13)
BK13_V5: CN2.89 U12.V5(IO_L6N_T0_VREF_13)
BK13_V6: CN2.87 U12.V6(IO_L22P_T3_13)
BK13_V7: CN2.84 U12.V7(IO_L11N_T1_SRCC_13)
BK13_V8: CN2.82 U12.V8(IO_L15P_T2_DQS_13)
BK13_V10: CN2.71 U12.V10(IO_L21N_T3_DQS_13)
BK13_V11: CN2.69 U12.V11(IO_L21P_T3_DQS_13)
BK13_W6: CN2.85 U12.W6(IO_L22N_T3_13)
BK13_W8: CN2.80 U12.W8(IO_L15N_T2_DQS_13)
BK13_W9: CN2.75 U12.W9(IO_L16N_T2_13)
BK13_W10: CN2.73 U12.W10(IO_L16P_T2_13)
BK13_W11: CN2.63 U12.W11(IO_L18P_T2_13)
BK13_Y6: CN2.83 U12.Y6(IO_L13N_T2_MRCC_13)
BK13_Y7: CN2.81 U12.Y7(IO_L13P_T2_MRCC_13)
BK13_Y8: CN2.79 U12.Y8(IO_L14N_T2_SRCC_13)
BK13_Y9: CN2.77 U12.Y9(IO_L14P_T2_SRCC_13)
BK13_Y11: CN2.61 U12.Y11(IO_L18N_T2_13)
BK13_Y12: CN2.67 U12.Y12(IO_L20P_T3_13)
BK13_Y13: CN2.65 U12.Y13(IO_L20N_T3_13)
BK34_IO_0--R19: CN2.24 U12.R19(IO_0_34)
BK34_IO_25--T19: CN2.15 U12.T19(IO_25_34)
BK34_L1_N--T10: CN2.68 U12.T10(IO_L1N_T0_34)
BK34_L1_P--T11: CN2.66 U12.T11(IO_L1P_T0_34)
BK34_L2_N--U12: CN2.62 U12.U12(IO_L2N_T0_34)
BK34_L2_P--T12: CN2.64 U12.T12(IO_L2P_T0_34)
BK34_L4_N--W13: CN2.55 U12.W13(IO_L4N_T0_34)
BK34_L4_P--V12: CN2.57 U12.V12(IO_L4P_T0_34)
BK34_L5_N--T15: CN2.44 U12.T15(IO_L5N_T0_34)
BK34_L5_P--T14: CN2.46 U12.T14(IO_L5P_T0_34)
BK34_L6_N--R14: CN2.58 U12.R14(IO_L6N_T0_VREF_34)
BK34_L6_P--P14: CN2.60 U12.P14(IO_L6P_T0_34)
BK34_L7_N--Y17: CN2.39 U12.Y17(IO_L7N_T1_34)
BK34_L7_P--Y16: CN2.37 U12.Y16(IO_L7P_T1_34)
BK34_L8_N--Y14: CN2.51 U12.Y14(IO_L8N_T1_34)
BK34_L8_P--W14: CN2.53 U12.W14(IO_L8P_T1_34)
BK34_L9_N--U17: CN2.40 U12.U17(IO_L9N_T1_DQS_34)
BK34_L9_P--T16: CN2.42 U12.T16(IO_L9P_T1_DQS_34)
BK34_L10_N--W15: CN2.47 U12.W15(IO_L10N_T1_34)
BK34_L10_P--V15: CN2.49 U12.V15(IO_L10P_T1_34)
BK34_L11_N--U15: CN2.48 U12.U15(IO_L11N_T1_SRCC_34)
BK34_L11_P--U14: CN2.50 U12.U14(IO_L11P_T1_SRCC_34)
BK34_L13_N--P19: CN2.18 U12.P19(IO_L13N_T2_MRCC_34)
BK34_L13_P--N18: CN2.16 U12.N18(IO_L13P_T2_MRCC_34)
BK34_L14_N--P20: CN2.14 U12.P20(IO_L14N_T2_SRCC_34)
BK34_L14_P--N20: CN2.12 U12.N20(IO_L14P_T2_SRCC_34)
BK34_L15_N--U20: CN2.11 U12.U20(IO_L15N_T2_DQS_34)
BK34_L15_P--T20: CN2.13 U12.T20(IO_L15P_T2_DQS_34)
BK34_L16_N--W20: CN2.23 U12.W20(IO_L16N_T2_34)
BK34_L16_P--V20: CN2.21 U12.V20(IO_L16P_T2_34)
BK34_L17_N--Y19: CN2.29 U12.Y19(IO_L17N_T2_34)
BK34_L17_P--Y18: CN2.31 U12.Y18(IO_L17P_T2_34)
BK34_L18_N--W16: CN2.43 U12.W16(IO_L18N_T2_34)
BK34_L18_P--V16: CN2.45 U12.V16(IO_L18P_T2_34)
BK34_L19_N--R17: CN2.26 U12.R17(IO_L19N_T3_VREF_34)
BK34_L19_P--R16: CN2.28 U12.R16(IO_L19P_T3_34)
BK34_L20_N--R18: CN2.36 U12.R18(IO_L20N_T3_34)
BK34_L20_P--T17: CN2.38 U12.T17(IO_L20P_T3_34)
BK34_L21_N--V18: CN2.33 U12.V18(IO_L21N_T3_DQS_34)
BK34_L21_P--V17: CN2.35 U12.V17(IO_L21P_T3_DQS_34)
BK34_L22_N--W19: CN2.25 U12.W19(IO_L22N_T3_34)
BK34_L22_P--W18: CN2.27 U12.W18(IO_L22P_T3_34)
BK34_L23_N--P18: CN2.22 U12.P18(IO_L23N_T3_34)
BK34_L23_P--N17: CN2.20 U12.N17(IO_L23P_T3_34)
BK34_L24_N--P16: CN2.30 U12.P16(IO_L24N_T3_34)
BK34_L24_P--P15: CN2.32 U12.P15(IO_L24P_T3_34)
BK34_U13: CN2.56 R87.1 U12.U13(IO_L3P_T0_DQS_PUDC_B_34)
BK34_U19: CN2.17 U12.U19(IO_L12N_T1_MRCC_34)
BK34_V13: CN2.54 U12.V13(IO_L3N_T0_DQS_34)
BK35_A20: CN1.35 U12.A20(IO_L2N_T0_AD8N_35)
BK35_B19: CN1.33 U12.B19(IO_L2P_T0_AD8P_35)
BK35_B20: CN1.34 U12.B20(IO_L1N_T0_AD0N_35)
BK35_C20: CN1.31 U12.C20(IO_L1P_T0_AD0P_35)
BK35_D18: CN1.32 U12.D18(IO_L3N_T0_DQS_AD1N_35)
BK35_D19: CN1.46 U12.D19(IO_L4P_T0_35)
BK35_D20: CN1.29 U12.D20(IO_L4N_T0_35)
BK35_E17: CN1.48 U12.E17(IO_L3P_T0_DQS_AD1P_35)
BK35_E18: CN1.47 U12.E18(IO_L5P_T0_AD9P_35)
BK35_E19: CN1.28 U12.E19(IO_L5N_T0_AD9N_35)
BK35_F16: CN1.50 U12.F16(IO_L6P_T0_35)
BK35_F17: CN1.49 U12.F17(IO_L6N_T0_VREF_35)
BK35_F19: CN1.59 U12.F19(IO_L15P_T2_DQS_AD12P_35)
BK35_F20: CN1.58 U12.F20(IO_L15N_T2_DQS_AD12N_35)
BK35_G15: CN1.30 U12.G15(IO_L19N_T3_VREF_35)
BK35_G17: CN1.61 U12.G17(IO_L16P_T2_35)
BK35_G18: CN1.60 U12.G18(IO_L16N_T2_35)
BK35_G19: CN1.57 U12.G19(IO_L18P_T2_AD13P_35)
BK35_G20: CN1.25 U12.G20(IO_L18N_T2_AD13N_35)
BK35_H15: CN1.27 U12.H15(IO_L19P_T3_35)
BK35_H16: CN1.51 U12.H16(IO_L13P_T2_MRCC_35)
BK35_H17: CN1.45 U12.H17(IO_L13N_T2_MRCC_35)
BK35_H18: CN1.56 U12.H18(IO_L14N_T2_AD4N_SRCC_35)
BK35_H20: CN1.23 U12.H20(IO_L17N_T2_AD5N_35)
BK35_IO_0--G14: CN1.52 U12.G14(IO_0_35)
BK35_IO_25--J15: CN1.55 U12.J15(IO_25_35)
BK35_J14: CN1.54 U12.J14(IO_L20N_T3_AD6N_35)
BK35_J16: R88.1 U12.J16(IO_L24N_T3_AD15N_35)
BK35_J18: CN1.43 U12.J18(IO_L14P_T2_AD4P_SRCC_35)
BK35_J19: CN1.41 U12.J19(IO_L10N_T1_AD11N_35)
BK35_J20: CN1.21 U12.J20(IO_L17P_T2_AD5P_35)
BK35_K14: CN1.26 U12.K14(IO_L20P_T3_AD6P_35)
BK35_K16: CN1.53 U12.K16(IO_L24P_T3_AD15P_35)
BK35_K17: CN1.44 U12.K17(IO_L12P_T1_MRCC_35)
BK35_K18: CN1.42 U12.K18(IO_L12N_T1_MRCC_35)
BK35_K19: CN1.40 U12.K19(IO_L10P_T1_AD11P_35)
BK35_L14: CN1.24 U12.L14(IO_L22P_T3_AD7P_35)
BK35_L15: CN1.36 U12.L15(IO_L22N_T3_AD7N_35)
BK35_L16: CN1.37 U12.L16(IO_L11P_T1_SRCC_35)
BK35_L17: CN1.38 U12.L17(IO_L11N_T1_SRCC_35)
BK35_L19: CN1.39 U12.L19(IO_L9P_T1_DQS_AD3P_35)
BK35_L20: CN1.18 U12.L20(IO_L9N_T1_DQS_AD3N_35)
BK35_M14: CN1.22 U12.M14(IO_L23P_T3_35)
BK35_M15: CN1.20 U12.M15(IO_L23N_T3_35)
BK35_M17: CN1.13 U12.M17(IO_L8P_T1_AD10P_35)
BK35_M18: CN1.14 U12.M18(IO_L8N_T1_AD10N_35)
BK35_M19: CN1.15 U12.M19(IO_L7P_T1_AD2P_35)
BK35_M20: CN1.16 U12.M20(IO_L7N_T1_AD2N_35)
BK35_N15: CN1.19 U12.N15(IO_L21P_T3_DQS_AD14P_35)
BK35_N16: CN1.17 U12.N16(IO_L21N_T3_DQS_AD14N_35)
BK500_MIO_0: R89.1 U12.E6(PS_MIO0_500)
BK500_MIO_2: R76.1 R80.1 U12.B8(PS_MIO2_500)
BK500_MIO_3: R77.1 R81.1 U12.D6(PS_MIO3_500)
BK500_MIO_4: R68.1 R78.1 U12.B7(PS_MIO4_500)
BK500_MIO_5: R69.1 R79.1 U12.A6(PS_MIO5_500)
BK500_MIO_6: R65.1 R82.1 U12.A5(PS_MIO6_500)
BK500_PS_POR_B_RST: R70.1 U12.C7(PS_POR_B_500) U29.2(RESET#)
BOOT_SW1: R69.2 R75.2 SW3.4(B1)
BOOT_SW2: R68.2 R74.2 SW3.3(B2)
CLK_33M: R63.1 U12.E7(PS_CLK_500)
CLK_50M: R86.2 R122.2 X6.3(Output)
DDR3_A0: U6.N3(A0) U7.N3(A0) U12.N2(PS_DDR_A0_502)
DDR3_A1: U6.P7(A1) U7.P7(A1) U12.K2(PS_DDR_A1_502)
DDR3_A2: U6.P3(A2) U7.P3(A2) U12.M3(PS_DDR_A2_502)
DDR3_A3: U6.N2(A3) U7.N2(A3) U12.K3(PS_DDR_A3_502)
DDR3_A4: U6.P8(A4) U7.P8(A4) U12.M4(PS_DDR_A4_502)
DDR3_A5: U6.P2(A5) U7.P2(A5) U12.L1(PS_DDR_A5_502)
DDR3_A6: U6.R8(A6) U7.R8(A6) U12.L4(PS_DDR_A6_502)
DDR3_A7: U6.R2(A7) U7.R2(A7) U12.K4(PS_DDR_A7_502)
DDR3_A8: U6.T8(A8) U7.T8(A8) U12.K1(PS_DDR_A8_502)
DDR3_A9: U6.R3(A9) U7.R3(A9) U12.J4(PS_DDR_A9_502)
DDR3_A10: U6.L7(A10/AP) U7.L7(A10/AP) U12.F5(PS_DDR_A10_502)
DDR3_A11: U6.R7(A11) U7.R7(A11) U12.G4(PS_DDR_A11_502)
DDR3_A12: U6.N7(A12/BC#) U7.N7(A12/BC#) U12.E4(PS_DDR_A12_502)
DDR3_A13: U6.T3(A13) U7.T3(A13) U12.D4(PS_DDR_A13_502)
DDR3_A14: U6.T7(A14) U7.T7(A14) U12.F4(PS_DDR_A14_502)
DDR3_BA0: U6.M2(BA0) U7.M2(BA0) U12.L5(PS_DDR_BA0_502)
DDR3_BA1: U6.N8(BA1) U7.N8(BA1) U12.R4(PS_DDR_BA1_502)
DDR3_BA2: U6.M3(BA2) U7.M3(BA2) U12.J5(PS_DDR_BA2_502)
DDR3_CAS: U6.K3(CAS#) U7.K3(CAS#) U12.P5(PS_DDR_CAS_B_502)
DDR3_CKE: U6.K9(CKE) U7.K9(CKE) U12.N3(PS_DDR_CKE_502)
DDR3_CLK_N: R109.1 U6.K7(CK#) U7.K7(CK#) U12.M2(PS_DDR_CKN_502)
DDR3_CLK_P: R109.2 U6.J7(CK) U7.J7(CK) U12.L2(PS_DDR_CKP_502)
DDR3_D0: U6.H7(DQL7) U12.C3(PS_DDR_DQ0_502)
DDR3_D1: U6.G2(DQL6) U12.B3(PS_DDR_DQ1_502)
DDR3_D2: U6.F2(DQL2) U12.A2(PS_DDR_DQ2_502)
DDR3_D3: U6.H3(DQL4) U12.A4(PS_DDR_DQ3_502)
DDR3_D4: U6.F7(DQL1) U12.D3(PS_DDR_DQ4_502)
DDR3_D5: U6.H8(DQL5) U12.D1(PS_DDR_DQ5_502)
DDR3_D6: U6.E3(DQL0) U12.C1(PS_DDR_DQ6_502)
DDR3_D7: U6.F8(DQL3) U12.E1(PS_DDR_DQ7_502)
DDR3_D8: U6.C2(DQU3) U12.E2(PS_DDR_DQ8_502)
DDR3_D9: U6.A3(DQU7) U12.E3(PS_DDR_DQ9_502)
DDR3_D10: U6.A2(DQU5) U12.G3(PS_DDR_DQ10_502)
DDR3_D11: U6.C3(DQU1) U12.H3(PS_DDR_DQ11_502)
DDR3_D12: U6.D7(DQU0) U12.J3(PS_DDR_DQ12_502)
DDR3_D13: U6.B8(DQU6) U12.H2(PS_DDR_DQ13_502)
DDR3_D14: U6.A7(DQU4) U12.H1(PS_DDR_DQ14_502)
DDR3_D15: U6.C8(DQU2) U12.J1(PS_DDR_DQ15_502)
DDR3_D16: U7.F2(DQL2) U12.P1(PS_DDR_DQ16_502)
DDR3_D17: U7.G2(DQL6) U12.P3(PS_DDR_DQ17_502)
DDR3_D18: U7.H3(DQL4) U12.R3(PS_DDR_DQ18_502)
DDR3_D19: U7.E3(DQL0) U12.R1(PS_DDR_DQ19_502)
DDR3_D20: U7.F8(DQL3) U12.T4(PS_DDR_DQ20_502)
DDR3_D21: U7.H8(DQL5) U12.U4(PS_DDR_DQ21_502)
DDR3_D22: U7.H7(DQL7) U12.U2(PS_DDR_DQ22_502)
DDR3_D23: U7.F7(DQL1) U12.U3(PS_DDR_DQ23_502)
DDR3_D24: U7.C2(DQU3) U12.V1(PS_DDR_DQ24_502)
DDR3_D25: U7.D7(DQU0) U12.Y3(PS_DDR_DQ25_502)
DDR3_D26: U7.C3(DQU1) U12.W1(PS_DDR_DQ26_502)
DDR3_D27: U7.B8(DQU6) U12.Y4(PS_DDR_DQ27_502)
DDR3_D28: U7.C8(DQU2) U12.Y2(PS_DDR_DQ28_502)
DDR3_D29: U7.A7(DQU4) U12.W3(PS_DDR_DQ29_502)
DDR3_D30: U7.A2(DQU5) U12.V2(PS_DDR_DQ30_502)
DDR3_D31: U7.A3(DQU7) U12.V3(PS_DDR_DQ31_502)
DDR3_DM0: U6.E7(DML) U12.A1(PS_DDR_DM0_502)
DDR3_DM1: U6.D3(DMU) U12.F1(PS_DDR_DM1_502)
DDR3_DM2: U7.E7(DML) U12.T1(PS_DDR_DM2_502)
DDR3_DM3: U7.D3(DMU) U12.Y1(PS_DDR_DM3_502)
DDR3_DQS0_N: U6.G3(DQSL#) U12.B2(PS_DDR_DQS_N0_502)
DDR3_DQS0_P: U6.F3(DQSL) U12.C2(PS_DDR_DQS_P0_502)
DDR3_DQS1_N: U6.B7(DQSU#) U12.F2(PS_DDR_DQS_N1_502)
DDR3_DQS1_P: U6.C7(DQSU) U12.G2(PS_DDR_DQS_P1_502)
DDR3_DQS2_N: U7.G3(DQSL#) U12.T2(PS_DDR_DQS_N2_502)
DDR3_DQS2_P: U7.F3(DQSL) U12.R2(PS_DDR_DQS_P2_502)
DDR3_DQS3_N: U7.B7(DQSU#) U12.W4(PS_DDR_DQS_N3_502)
DDR3_DQS3_P: U7.C7(DQSU) U12.W5(PS_DDR_DQS_P3_502)
DDR3_ODT: U6.K1(ODT) U7.K1(ODT) U12.N5(PS_DDR_ODT_502)
DDR3_RAS: U6.J3(RAS#) U7.J3(RAS#) U12.P4(PS_DDR_RAS_B_502)
DDR3_RESET: R25.2 U6.T2(RESET#) U7.T2(RESET#) U12.B4(PS_DDR_DRST_B_502)
DDR3_S0: U6.L2(CS#) U7.L2(CS#) U12.N1(PS_DDR_CS_B_502)
DDR3_VRN: R85.1 U12.G5(PS_DDR_VRN_502)
DDR3_VRP: R119.1 U12.H5(PS_DDR_VRP_502)
DDR3_WE: U6.L3(WE#) U7.L3(WE#) U12.M5(PS_DDR_WE_B_502)
FPGA_DONE: LED1.2(A) R111.2 U12.R11(DONE_0)
FPGA_TCK: CN1.99 H1.1 U12.F9(TCK_0)
FPGA_TDI: CN1.98 H1.4 U12.G6(TDI_0)
FPGA_TDO: CN1.97 H1.2 U12.F6(TDO_0)
FPGA_TMS: CN1.100 H1.3 U12.J6(TMS_0)
MMC_CLK: R15.2 U12.B12(PS_MIO48_501)
MMC_CMD: R17.2 U12.B14(PS_MIO47_501)
MMC_D0: R106.2 U12.D16(PS_MIO46_501)
MMC_D1: R12.2 U12.C12(PS_MIO49_501)
MMC_D2: R13.2 U12.B13(PS_MIO50_501)
MMC_D3: R14.2 U12.B9(PS_MIO51_501)
MMC_RSTN: R16.1 U27.K5(RSTN)
MMCD0: R106.1 U27.A3(DAT0)
MMCD1: R12.1 U27.A4(DAT1)
MMCD2: R13.1 U27.A5(DAT2)
MMCD3: R14.1 U27.B2(DAT3)
MMCLK: R15.1 U27.M6(CLK)
MMCMD: R17.1 U27.M5(CMD)
NET_CLK: R122.1 U17.42(CKXTAL1)
PHY_INTB: R61.2 U17.20(INTB)
PHY_LED0: CN1.1 U17.34(LED0/PHY_AD0)
PHY_LED1: CN1.2 U17.35(LED1/PHY_AD1)
PHY_MDC: U12.C10(PS_MIO52_501) U17.30(MDC)
PHY_MDI0_N: CN1.5 U17.2(MDI[0]-)
PHY_MDI0_P: CN1.3 U17.1(MDI[0]+)
PHY_MDI1_N: CN1.9 U17.5(MDI[1]-)
PHY_MDI1_P: CN1.7 U17.4(MDI[1]+)
PHY_MDI2_N: CN1.6 U17.8(MDI[2]-)
PHY_MDI2_P: CN1.4 U17.7(MDI[2]+)
PHY_MDI3_N: CN1.10 U17.11(MDI[3]-)
PHY_MDI3_P: CN1.8 U17.10(MDI[3]+)
PHY_MDIO: R62.2 U12.C11(PS_MIO53_501) U17.31(MDIO)
PHY_RX_CLK: U12.B17(PS_MIO22_501) U17.19(RXC)
PHY_RXCTL: U12.D13(PS_MIO27_501) U17.13(RXCTL/PHY_AD)
PHY_RXD0: U12.D11(PS_MIO23_501) U17.14(RXD[0]/SELRGV)
PHY_RXD1: U12.A16(PS_MIO24_501) U17.16(RXD[1]/TXDLY)
PHY_RXD2: U12.F15(PS_MIO25_501) U17.17(RXD[2]/AN0)
PHY_RXD3: U12.A15(PS_MIO26_501) U17.18(RXD[3]/AN1)
PHY_TX_CLK: U12.A19(PS_MIO16_501) U17.22(TXC)
PHY_TXCTL: U12.F14(PS_MIO21_501) U17.27(TXCTL)
PHY_TXD0: U12.E14(PS_MIO17_501) U17.23(TXD[0])
PHY_TXD1: U12.B18(PS_MIO18_501) U17.24(TXD[1])
PHY_TXD2: U12.D10(PS_MIO19_501) U17.25(TXD[2])
PHY_TXD3: U12.A17(PS_MIO20_501) U17.26(TXD[3])
PHYRSTB: R64.2 U17.29(PHYRSTB)
PL_CLK: R86.1 U12.U18(IO_L12P_T1_MRCC_34)
PS500_MIO7: CN1.92 R83.1 U12.D8(PS_MIO7_500)
PS500_MIO8: CN1.95 R84.1 U12.D5(PS_MIO8_500)
PS500_MIO9: CN1.96 U12.B5(PS_MIO9_500)
PS500_MIO10: CN1.91 U12.E9(PS_MIO10_500)
PS500_MIO11: CN1.94 U12.C6(PS_MIO11_500)
PS500_MIO12: CN1.90 U12.D9(PS_MIO12_500)
PS500_MIO13: CN1.93 U12.E8(PS_MIO13_500)
PS500_MIO14_UART_RXD: CN1.89 U12.C5(PS_MIO14_500)
PS500_MIO15_UART_TXD: CN1.87 U12.C8(PS_MIO15_500)
PS501_MIO28_OTG_D4: CN1.66 U12.C16(PS_MIO28_501)
PS501_MIO29_OTG_DIR: CN1.69 U12.C13(PS_MIO29_501)
PS501_MIO30_OTG_STP: CN1.67 U12.C15(PS_MIO30_501)
PS501_MIO31_OTG_NXT: CN1.65 U12.E16(PS_MIO31_501)
PS501_MIO32_OTG_D0: CN1.70 U12.A14(PS_MIO32_501)
PS501_MIO33_OTG_D1: CN1.68 U12.D15(PS_MIO33_501)
PS501_MIO34_OTG_D2: CN1.72 U12.A12(PS_MIO34_501)
PS501_MIO35_OTG_D3: CN1.75 U12.F12(PS_MIO35_501)
PS501_MIO36_OTG_CLK: CN1.71 U12.A11(PS_MIO36_501)
PS501_MIO37_OTG_D5: CN1.74 U12.A10(PS_MIO37_501)
PS501_MIO38_OTG_D6: CN1.73 U12.E13(PS_MIO38_501)
PS501_MIO39_OTG_D7: CN1.64 U12.C18(PS_MIO39_501)
PS501_MIO40_SD0_SCK: CARD1.5(CLK(SCLK)) U12.D14(PS_MIO40_501)
PS501_MIO41_SD0_CMD: CARD1.3(CMD(DI)) R90.1 U12.C17(PS_MIO41_501)
PS501_MIO42_SD0_D0: CARD1.7(DAT0(D0)) U12.E12(PS_MIO42_501)
PS501_MIO43_SD0_D1: CARD1.8(DAT1(RSV)) U12.A9(PS_MIO43_501)
PS501_MIO44_SD0_D2: CARD1.1(DAT2(RSV)) U12.F13(PS_MIO44_501)
PS501_MIO45_SD0_D3: CARD1.2(CDDAT3(CS)) R92.1 U12.B15(PS_MIO45_501)
QSPI_CS: U12.A7(PS_MIO1_500) U25.1(CS#)
QSPI_D0: R76.2 U25.5(DI(IO0))
QSPI_D1: R77.2 U25.2(DO(IO1))
QSPI_D2: R78.2 U25.3(WP#(IO2))
QSPI_D3: R79.2 U25.7(HOLD# or RESET#(IO3))
QSPI_SCK: R65.2 U25.6(CLK)
REF1V65: C65.1 C93.1 R72.1 R73.2 U12.E11(PS_MIO_VREF_501)
VB13: C84.1 C85.1 C86.1 C87.1 C157.2 R115.2 R118.2 U12.T8(VCCO_13) U12.U11(VCCO_13) U12.W7(VCCO_13) U12.Y10(VCCO_13)
VB34: C94.2 C104.1 C105.1 C112.1 C117.1 C118.1 C158.2 R57.2 R58.2 U12.N19(VCCO_34) U12.R15(VCCO_34) U12.T18(VCCO_34) U12.V14(VCCO_34) U12.W17(VCCO_34) U12.Y20(VCCO_34) X6.1(EN) X6.4(VDD)
VTTREF: C74.1 C75.1 C76.1 C78.2 C115.2 C144.1 C145.1 C163.2 R26.2 R29.2 U6.H1(VREFDQ) U6.M8(VREFCA) U7.H1(VREFDQ) U7.M8(VREFCA) U12.H6(PS_DDR_VREF0_502) U12.P6(PS_DDR_VREF1_502) VRF1.1
$1N35675: R123.2 R124.1 U23.1(FB)
$1N35676: L9.1 U23.6(LX)
$1N37905: R100.1 U23.2(PG)
$1N38120: R3.1 U23.7(EN)
$1N39903: L1.1 U1.6(LX)
$1N39906: R1.1 U1.2(PG)
$1N39907: C111.2 R2.1 U1.7(EN)
$1N39910: R127.1 R128.2 U1.1(FB)
$1N42259: L2.1 U2.6(LX)
$1N42262: R5.1 U2.2(PG)
$1N42263: C110.2 R6.1 U2.7(EN)
$1N42267: R131.1 R132.1 U2.1(FB)
$1N45585: L3.1 U3.6(LX)
$1N45588: R8.1 U3.2(PG)
$1N45589: C114.2 R9.1 U3.7(EN)
$1N45593: R125.2 R126.1 U3.1(FB)
$2N9802: C108.1 C109.2 U27.C2(VDDI)
$3N1609: R63.2 X5.3(Output)
$3N2457: SW1.2 U29.3(MR#)
$3N2825: R71.1 U12.B10(PS_SRST_B_501)
$3N14970: LED3.2(A) R89.2
$4N7004: C81.2 C83.2 FB2.1 U12.G8(VCCPLL)
$5N14894: R27.1 U6.L8(ZQ)
$5N25093: R28.1 U7.L8(ZQ)
$6N10578: LED2.2(A) R88.2
$7N2811: R110.1 U12.R10(INIT_B_0)
$7N2920: R55.1 U12.L6(PROGRAM_B_0)
$7N3241: C80.2 FB1.1 U12.J9(VCCADC_0)
$7N4385: LED1.1(C) R56.1
$8N1784: R60.2 U17.39(RSET)
$8N1803: R59.1 U17.32(LED2/RXDLY)

Not connected (* = marked no-connect by the designer): CARD1 9(CD)*; CN2 9* 10* 91* 92*; U1 5(NC); U2 5(NC); U3 5(NC); U6 J1(NC) J9(NC) L1(NC) L9(NC) M7(NC); U7 J1(NC) J9(NC) L1(NC) L9(NC) M7(NC); U12 K9(VP_0)* L10(VN_0)*; U17 12(NC)* 33(PMEB)* 43(CKXTAL2) 44(VDDREG)* 45(VDDREG)* 46(CLK125)* 48(REG_OUT)*; U23 5(NC); U27 A1(NC) A2(NC) A7(RFU) A8(NC) A9(NC) A10(NC) A11(NC) A12(NC) A13(NC) A14(NC) B1(NC) B3(DAT4)* B4(DAT5)* B5(DAT6)* B6(DAT7)* B7(NC) B8(NC) B9(NC) B10(NC) B11(NC) B12(NC) B13(NC) B14(NC) C1(NC) C3(NC) C5(NC) C7(NC) C8(NC) C9(NC) C10(NC) C11(NC) C12(NC) C13(NC) C14(NC) D1(NC) D2(NC) D3(NC) D4(NC) D12(NC) D13(NC) D14(NC) E1(NC) E2(NC) E3(NC) E5(RFU) E8(RFU) E9(RFU) E10(RFU) E12(NC) E13(NC) E14(NC) F1(NC) F2(NC) F3(NC) F10(RFU) F12(NC) F13(NC) F14(NC) G1(NC) G2(NC) G3(RFU) G10(RFU) G12(NC) G13(NC) G14(NC) H1(NC) H2(NC) H3(NC) H5(DataStrobe) H12(NC) H13(NC) H14(NC) J1(NC) J2(NC) J3(NC) J12(NC) J13(NC) J14(NC) K1(NC) K2(NC) K3(NC) K6(RFU) K7(RFU) K10(RFU) K12(NC) K13(NC) K14(NC) L1(NC) L2(NC) L3(NC) L12(NC) L13(NC) L14(NC) M1(NC) M2(NC) M3(NC) M7(NC) M8(NC) M9(NC) M10(NC) M11(NC) M12(NC) M13(NC) M14(NC) N1(NC) N3(NC) N6(NC) N7(NC) N8(NC) N9(NC) N10(NC) N11(NC) N12(NC) N13(NC) N14(NC) P1(NC) P2(NC) P7(RFU) P8(NC) P9(NC) P10(RFU) P11(NC) P12(NC) P13(NC) P14(NC)

## Notes on the sheets
sheet 1
- 内部参考电压0.6V
- 内部参考电压0.6V
- 内部参考电压0.6V
- 内部参考电压0.6V
sheet 3
- JTAG    : MIO4->ON; MIO5->ON
  NAND    : MIO4->OFF; MIO5->ON
  QSPI    : MIO4->ON; MIO5->OFF
  TF Card : MIO4->OFF; MIO5->OFF
- MIO[8] = 1 ---- MIO bank1 voltage = 1.8V
- MIO[2] = 0 ---- cascaded JTAG
- MIO[3] = 0 ---- JTAG/NAND/Quad-SPI/SD
- MIO[6] = 0 ---- PLL used
- MIO[7] = 0 ---- MIO bank0 voltage = 3.3V
- 1V8 BANK
- 3V3 BANK
- 复位电路
sheet 4
- BK 0
- 7020
- PL BANK34
- BANK35
- DDR
- BK 500
- BK 501
sheet 6
- 1V8或3V3
- 3V3
- 3V3供电不考虑差分信号, 以引脚命名网络
- 初始化电平
sheet 7
- 芯片本体温度测量
sheet 8
- 禁用内部电源
- 模拟电源
- 数字IO电源
sheet 9
- BK35: 49
- BK34: 49
- BK13: 25
- PS:19
